# EasyEDA Pro project UnsungHeroes.eprj

# Schematic Schematic1

## Sheets
1 power_logic: Board Name: Board1; Create Date: 2026-03-30; Page Name: power_logic; Project Name: UnsungHeroes; Schematic Name: Schematic1; Update Date: 2026-05-08; Company: EasyEDA.com; Page Size: A4; Version: V1.0
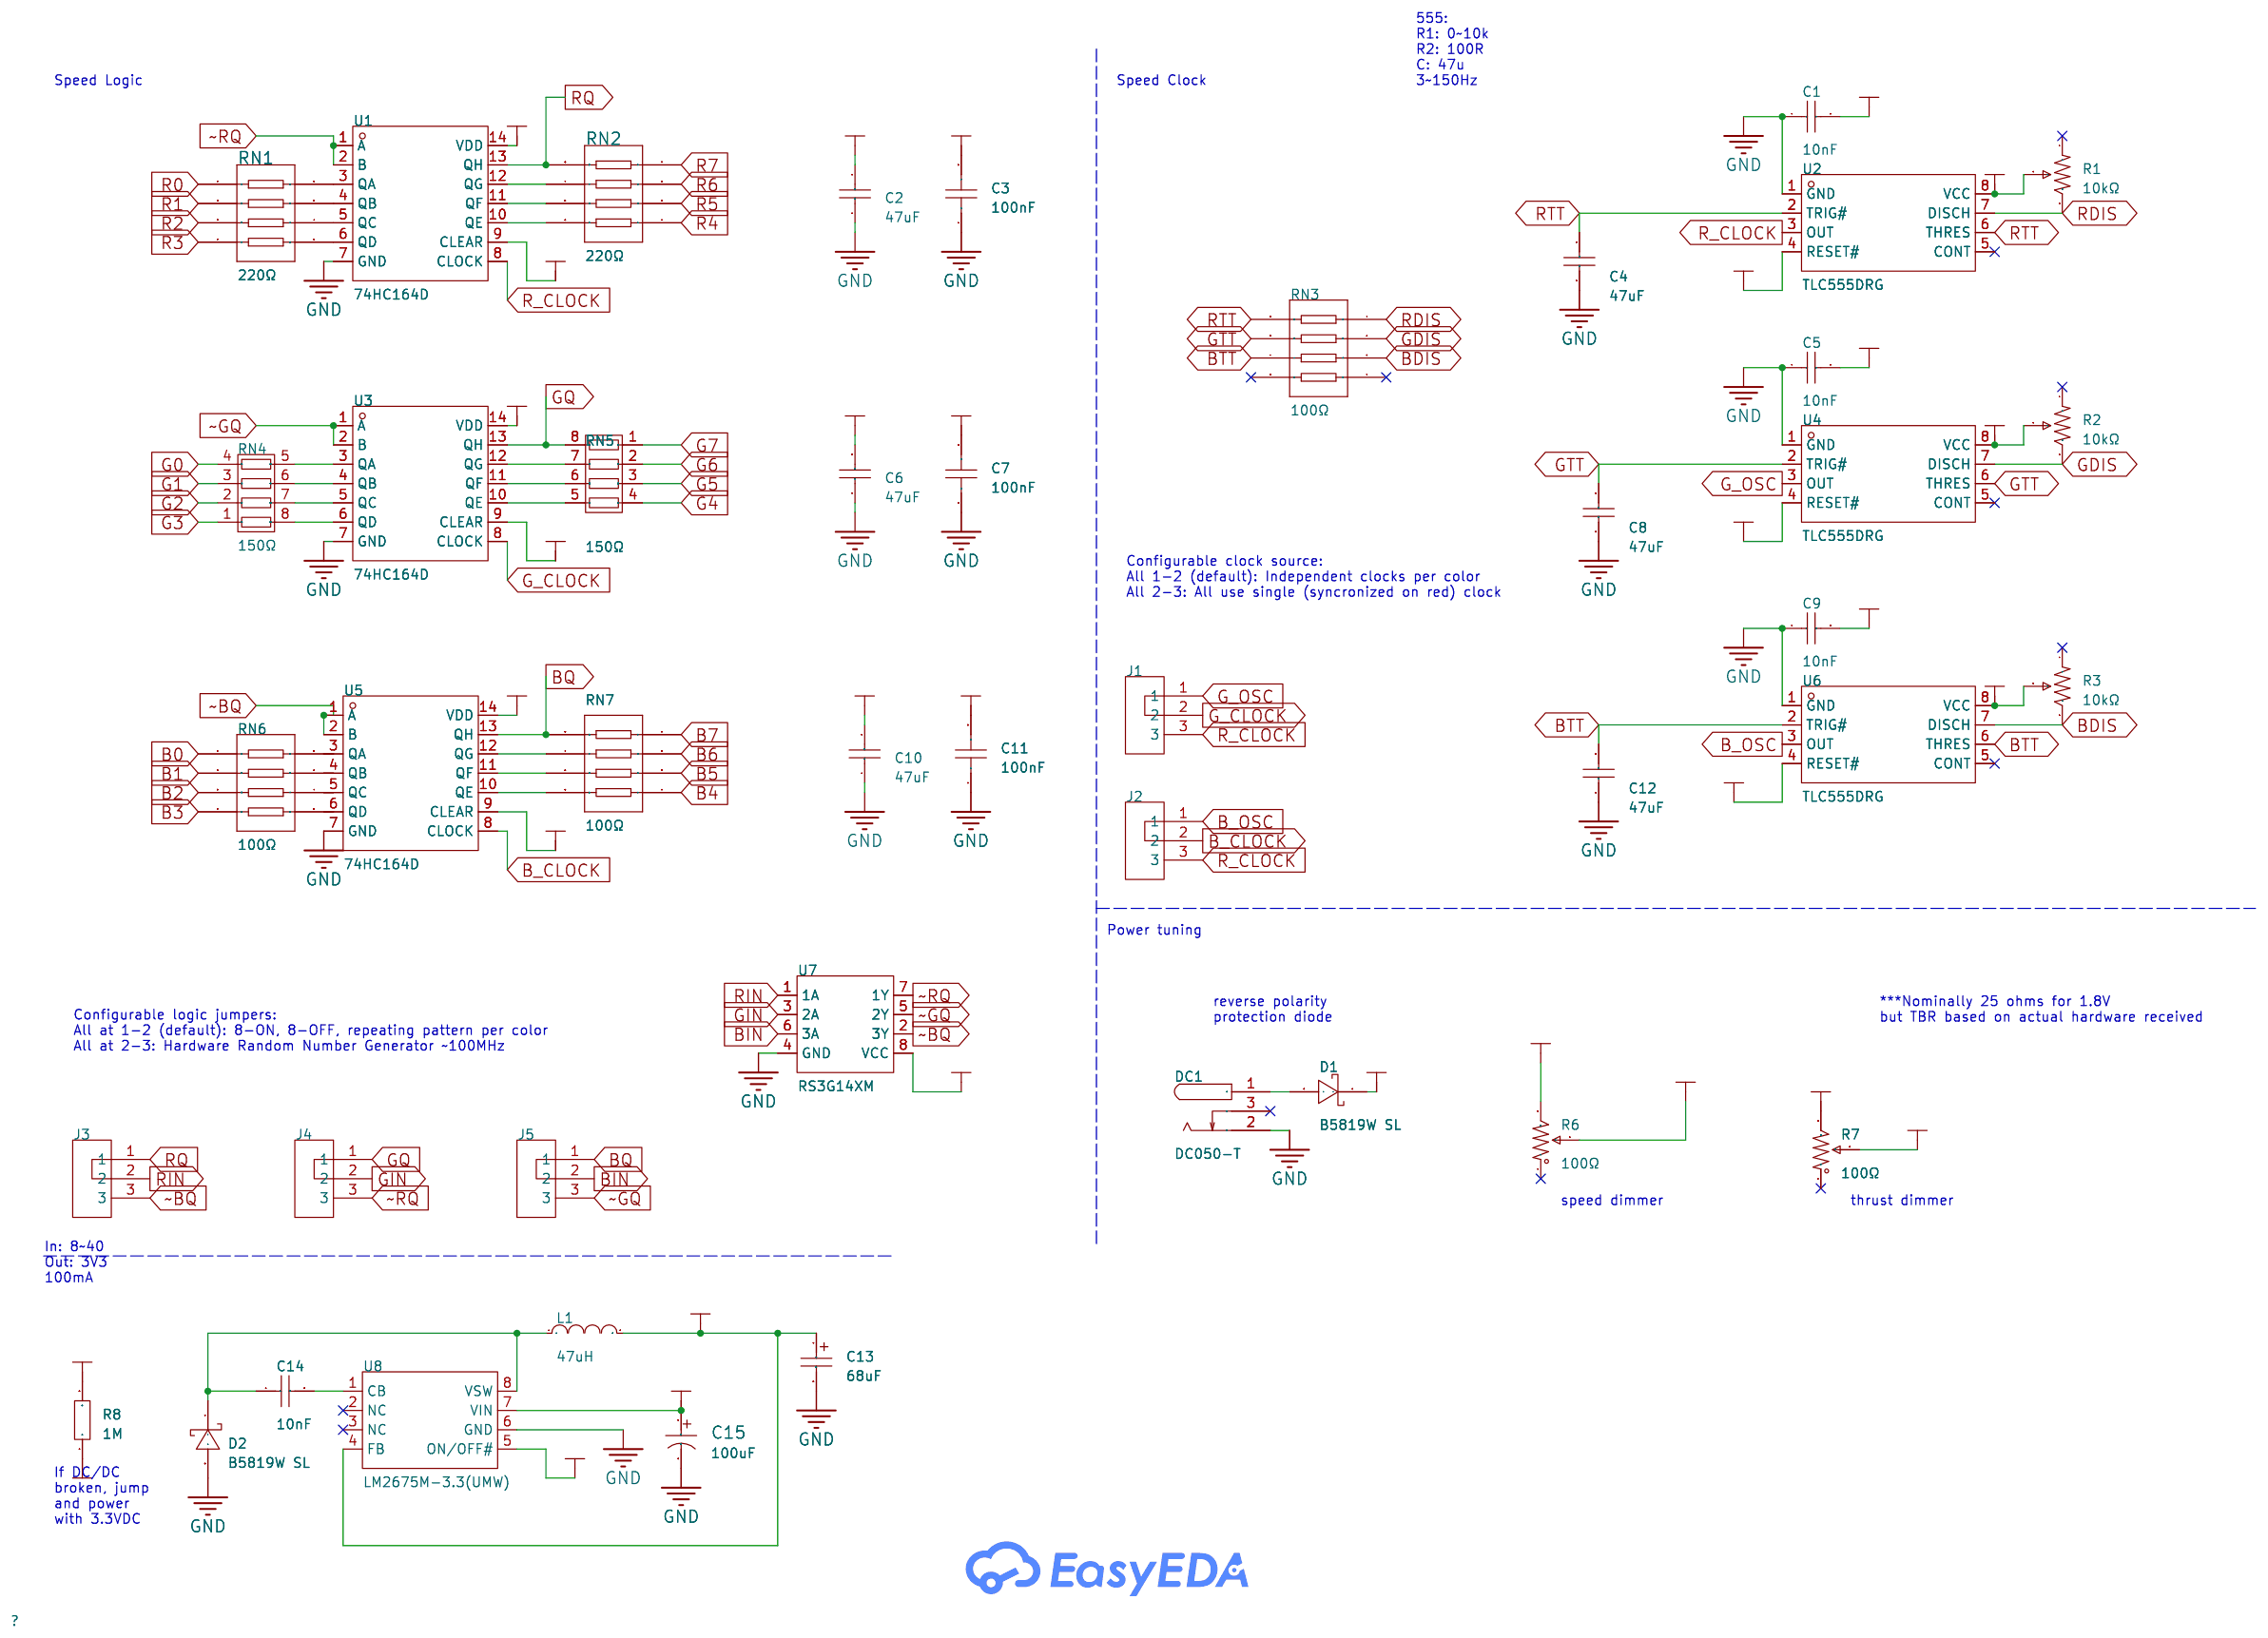
[diagram p0: power_logic]
2 led: Create Date: 2026-03-31; Page Name: led; Update Date: 2026-04-04
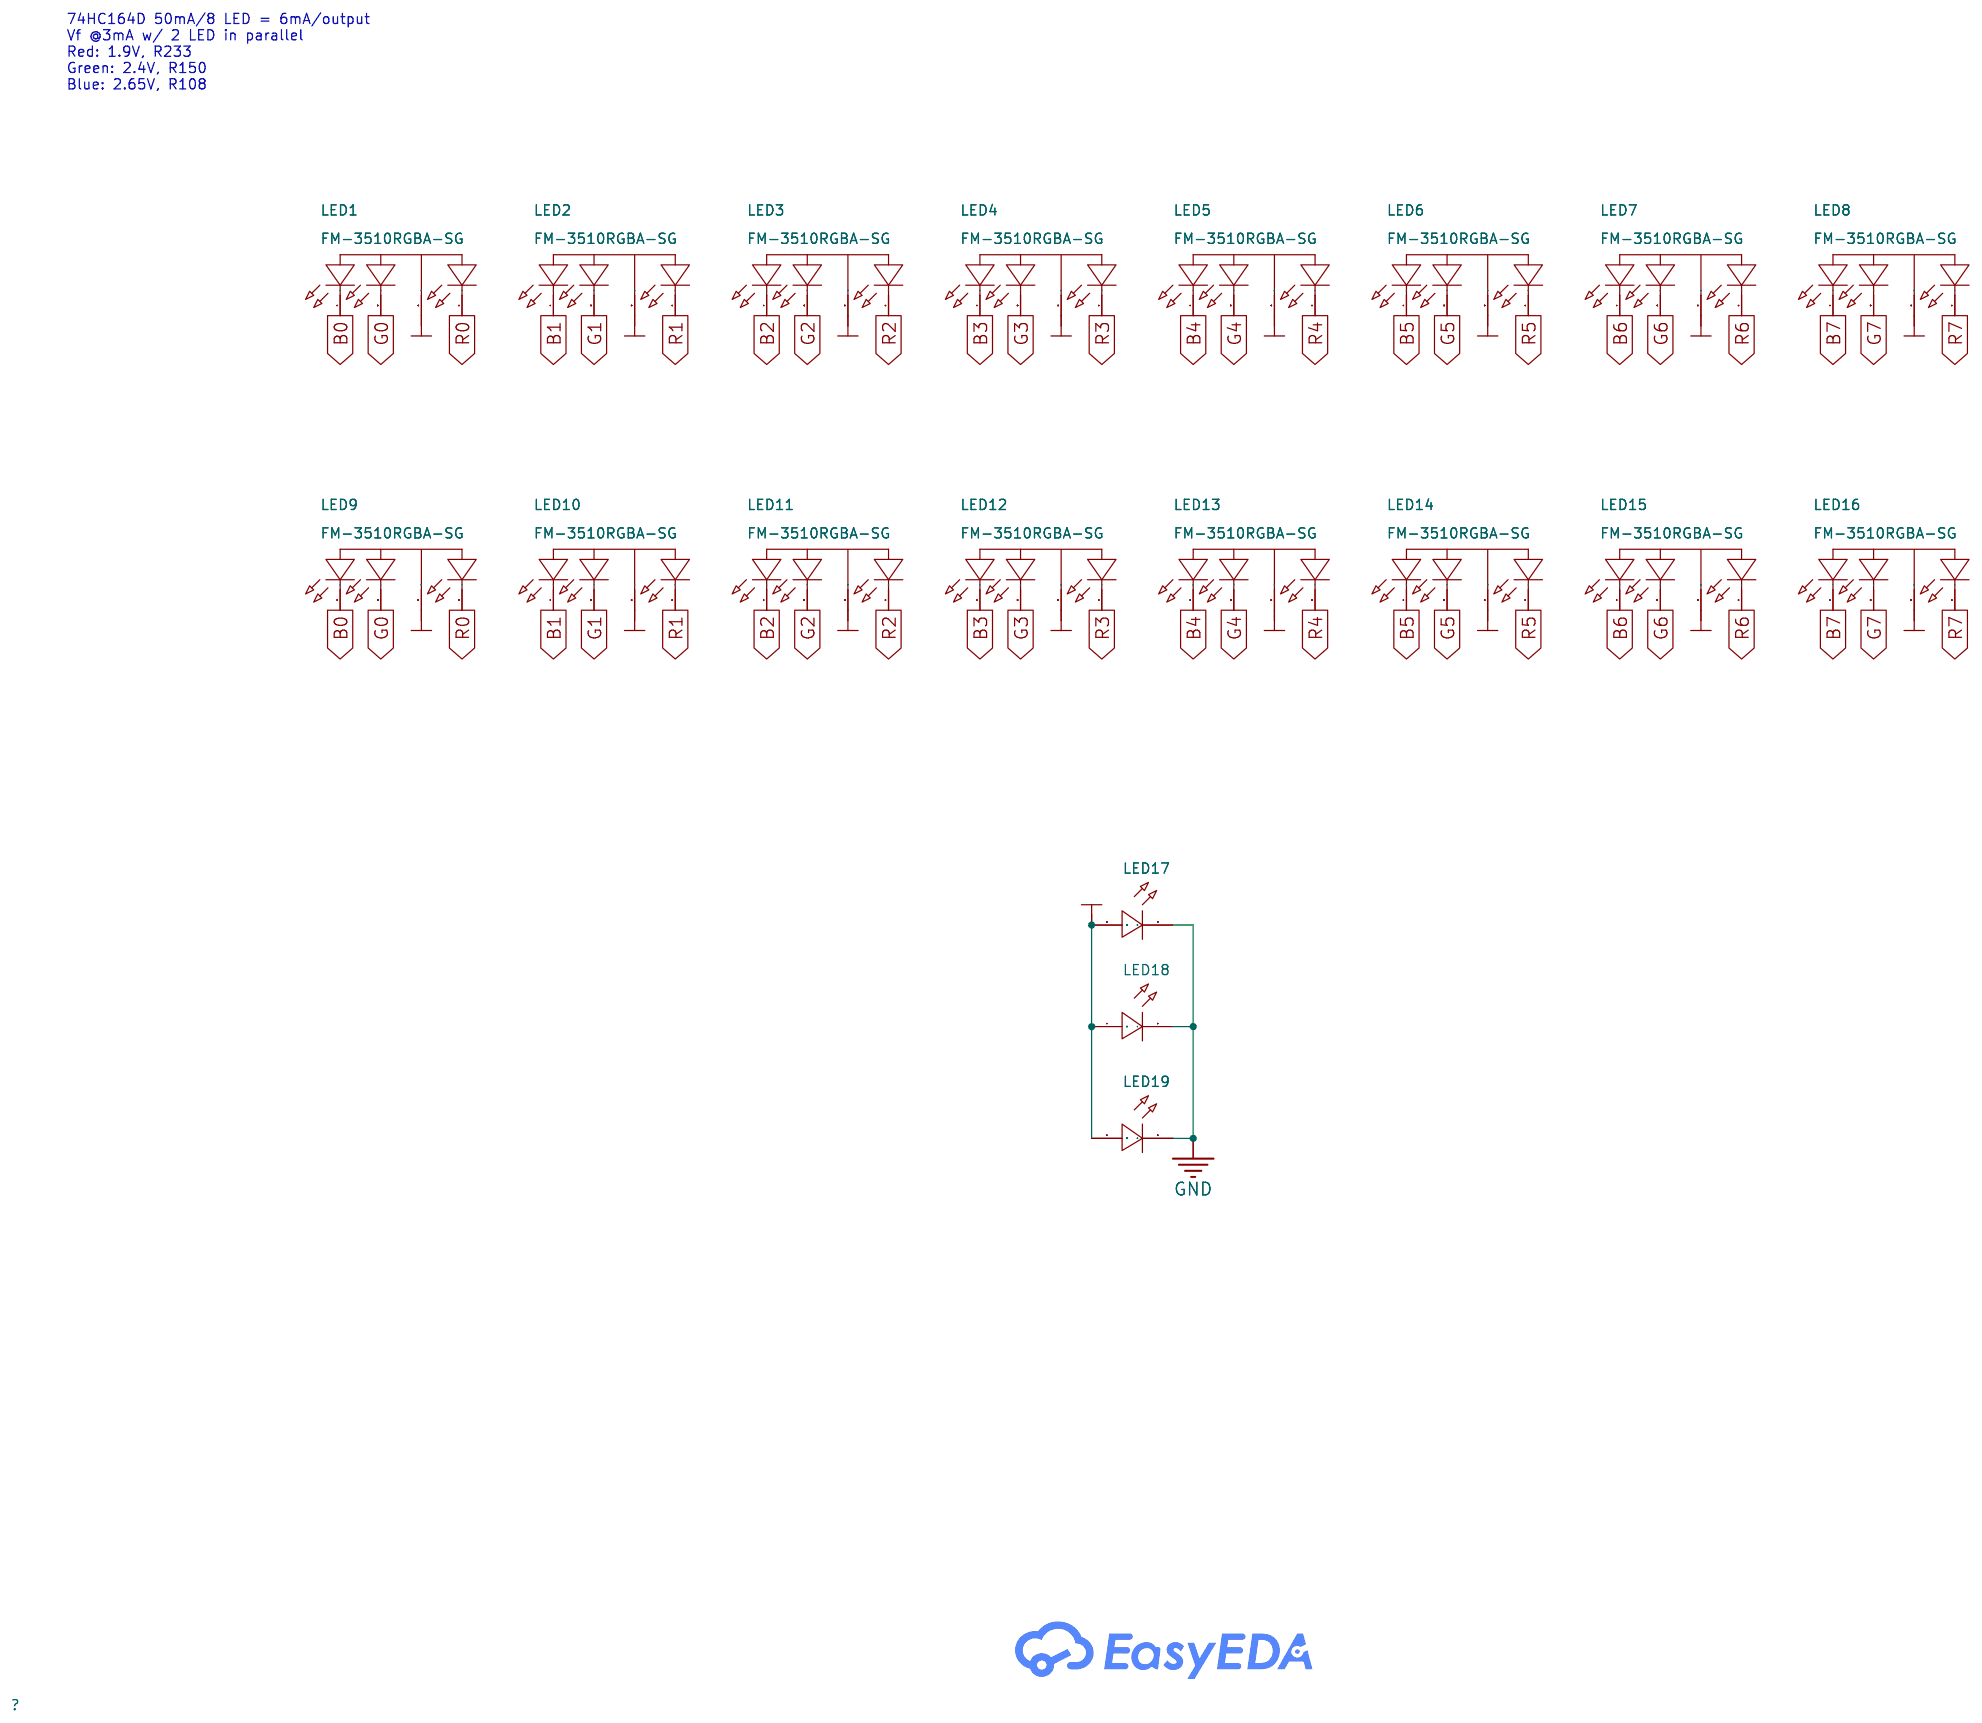
[diagram p1: led]

## Parts
sheet led
LED1  FM-3510RGBA-SG  [LED-SMD_FM-3510RGBA-SG]
LED2  FM-3510RGBA-SG  [LED-SMD_FM-3510RGBA-SG]
LED3  FM-3510RGBA-SG  [LED-SMD_FM-3510RGBA-SG]
LED4  FM-3510RGBA-SG  [LED-SMD_FM-3510RGBA-SG]
LED5  FM-3510RGBA-SG  [LED-SMD_FM-3510RGBA-SG]
LED6  FM-3510RGBA-SG  [LED-SMD_FM-3510RGBA-SG]
LED7  FM-3510RGBA-SG  [LED-SMD_FM-3510RGBA-SG]
LED8  FM-3510RGBA-SG  [LED-SMD_FM-3510RGBA-SG]
LED9  FM-3510RGBA-SG  [LED-SMD_FM-3510RGBA-SG]
LED10  FM-3510RGBA-SG  [LED-SMD_FM-3510RGBA-SG]
LED11  FM-3510RGBA-SG  [LED-SMD_FM-3510RGBA-SG]
LED12  FM-3510RGBA-SG  [LED-SMD_FM-3510RGBA-SG]
LED13  FM-3510RGBA-SG  [LED-SMD_FM-3510RGBA-SG]
LED14  FM-3510RGBA-SG  [LED-SMD_FM-3510RGBA-SG]
LED15  FM-3510RGBA-SG  [LED-SMD_FM-3510RGBA-SG]
LED16  FM-3510RGBA-SG  [LED-SMD_FM-3510RGBA-SG]
LED17  -  [3mm_cycling_led]  (no BOM)
LED18  -  [3mm_cycling_led]  (no BOM)
LED19  -  [3mm_cycling_led]  (no BOM)
sheet power_logic
C1  10nF  [C0402]
C2  47uF  [C0805]
C3  100nF  [C0402]
C4  47uF  [C0805]
C5  10nF  [C0402]
C6  47uF  [C0805]
C7  100nF  [C0402]
C8  47uF  [C0805]
C9  10nF  [C0402]
C10  47uF  [C0805]
C11  100nF  [C0402]
C12  47uF  [C0805]
C13  68uF  [CAP-SMD_L6.0-W3.2-R-RD]
C14  10nF  [C0402]
C15  100uF  [CAP-SMD_BD8.0-L8.3-W8.3-FD]
D1  B5819W SL  [SOD-123_L2.7-W1.6-LS3.7-RD-1]
D2  B5819W SL  [SOD-123_L2.7-W1.6-LS3.7-RD-1]
DC1  DC050-T  [DC-IN_DC050-T]
J1  -  [jumper3_12]  (no BOM)
J2  -  [jumper3_12]  (no BOM)
J3  -  [jumper3_12]  (no BOM)
J4  -  [jumper3_12]  (no BOM)
J5  -  [jumper3_12]  (no BOM)
L1  47uH  [L0805]
R1  10kΩ  [RES-ADJ-SMD_3P-L3.0-W3.8-P1.75-BR]
R2  10kΩ  [RES-ADJ-SMD_3P-L3.0-W3.8-P1.75-BR]
R3  10kΩ  [RES-ADJ-SMD_3P-L3.0-W3.8-P1.75-BR]
R6  100Ω  [RES-ADJ-SMD_TC33X-2-104E]
R7  100Ω  [RES-ADJ-SMD_TC33X-2-104E]
R8  1M  [R0805]  (no BOM)
RN1  220Ω  [RES-ARRAY-SMD_0402-8P-L2.0-W1.0-BL]
RN2  220Ω  [RES-ARRAY-SMD_0402-8P-L2.0-W1.0-BL]
RN3  100Ω  [RES-ARRAY-SMD_0402-8P-L2.0-W1.0-BL]
RN4  150Ω  [RES-ARRAY-SMD_0402-8P-L2.0-W1.0-BL]
RN5  150Ω  [RES-ARRAY-SMD_0402-8P-L2.0-W1.0-BL]
RN6  100Ω  [RES-ARRAY-SMD_0402-8P-L2.0-W1.0-BL]
RN7  100Ω  [RES-ARRAY-SMD_0402-8P-L2.0-W1.0-BL]
U1  74HC164D  [SOP-14_L8.6-W3.9-P1.27-LS6.0-BL]
U2  TLC555DRG  [SOP-8_L5.0-W3.9-P1.27-LS6.0-BL]
U3  74HC164D  [SOP-14_L8.6-W3.9-P1.27-LS6.0-BL]
U4  TLC555DRG  [SOP-8_L5.0-W3.9-P1.27-LS6.0-BL]
U5  74HC164D  [SOP-14_L8.6-W3.9-P1.27-LS6.0-BL]
U6  TLC555DRG  [SOP-8_L5.0-W3.9-P1.27-LS6.0-BL]
U7  RS3G14XM  [MSOP-8_L3.0-W3.0-P0.65-LS4.9-BL]
U8  LM2675M-3.3(UMW)  [SOIC-8_L4.9-W3.8-P1.27-LS6.0-BL]

## Library data of the parts
LED1-LED16 = FM-3510RGBA-SG: Diode Configuration:Common Anode Wavelength - Dominant:R:621nm；G:529nm；B:470nm Luminous Intensity:B:104mcd；R:445mcd；G:762mcd Viewing Angle:110° Forward Current:R:15mA；B:5mA；G:8mA Forward Voltage(Vf):G:2.7V；R:2.1V；B:2.7V Power(Watts):G:90mW；R:60mW；B:90mW I; LCSC Part Name: FFC排线B面（反面）; Supplier Part: C727903; Manufacturer: 国星光电; Supplier Footprint: SMD,3.5x1.3mm; JLCPCB Part Class: Extended Part; Datasheet: https://item.szlcsc.com/datasheet/FM-3510RGBA-SG/775226.html; Supplier: LCSC; Diode Configuration: Common Anode; Wavelength - Dominant: R:621nm；G:529nm；B:470nm; Luminous Intensity: B:104mcd；R:445mcd；G:762mcd; Viewing Angle: 110°; Forward Current: R:15mA；B:5mA；G:8mA; Forward Voltage(Vf): G:2.7V；R:2.1V；B:2.7V; Power(Watts): G:90mW；R:60mW；B:90mW; Installation Method: Side View Mount; Operating Temperature: -30℃~+85℃; Length: 3.5mm; Width: 1.2mm; Height: 1mm
LED17-LED19 = LED_TH-R_3mm: Supplier Footprint: Through
C1 C5 C9 C14 = CL05B103KB5NNNC: LCSC Part Name: 10nF ±10% 50V; Supplier Part: C15195; Manufacturer: SAMSUNG(三星); Supplier Footprint: 0402; JLCPCB Part Class: Basic Part; Datasheet: https://item.szlcsc.com/datasheet/CL05B103KB5NNNC/15869.html; Supplier: LCSC; Tolerance: ±10%; Voltage Rating: 50V; Temperature Coefficient: X7R
C2 C4 C6 C8 C10 C12 = CL21A476MQYNNNE: LCSC Part Name: 47uF ±20% 6.3V; Supplier Part: C16780; Manufacturer: SAMSUNG(三星); Supplier Footprint: 0805; JLCPCB Part Class: Basic Part; Datasheet: https://item.szlcsc.com/datasheet/CL21A476MQYNNNE/17464.html; Supplier: LCSC; Tolerance: ±20%; Voltage Rating: 6.3V; Temperature Coefficient: X5R
C3 C7 C11 = CL05B104KO5NNNC: LCSC Part Name: 100nF ±10% 16V; Supplier Part: C1525; Manufacturer: SAMSUNG(三星); Supplier Footprint: 0402; JLCPCB Part Class: Basic Part; Datasheet: https://item.szlcsc.com/datasheet/CL05B104KO5NNNC/1877.html; Supplier: LCSC; Tolerance: ±10%; Voltage Rating: 16V; Temperature Coefficient: X7R
C13 = TAJC686K016RNJ: LCSC Part Name: 68uF ±10% 16V; Supplier Part: C7220; Manufacturer: Kyocera AVX; Supplier Footprint: CASE-C-6032-28(mm); JLCPCB Part Class: Extended Part; Supplier: LCSC; Tolerance: ±10%; Voltage Rating: 16V; Equivalent Series Resistance(ESR): 1.3Ω@100kHz; Operating Temperature: -55℃~+125℃
C15 = UUD1H101MNL1GS: LCSC Part Name: 100uF ±20% 50V; Supplier Part: C116241; Manufacturer: Nichicon(尼吉康); Supplier Footprint: SMD,D8xL10mm; JLCPCB Part Class: Extended Part; Datasheet: https://item.szlcsc.com/datasheet/UUD1H101MNL1GS/117494.html; Supplier: LCSC; Tolerance: ±20%; Voltage Rating: 50V; Ripple Current: 150mA@120Hz; Diameter: 8mm; Height - Seated (Max): 10.5mm; Lifetime: 5000hrs@105℃; Operating Temperature: -55℃~+105℃
D1 D2 = B5819W SL: LCSC Part Name: 电压:40V 电流:1A; Supplier Part: C8598; Manufacturer: CJ(江苏长电/长晶); Supplier Footprint: SOD-123; JLCPCB Part Class: Basic Part; Datasheet: https://item.szlcsc.com/datasheet/B5819W%2520SL/9093.html; Supplier: LCSC; Voltage - Forward(Vf@If): 600mV@1A; Voltage - DC Reverse(Vr): 40V; Current - Rectified: 1A; Non-Repetitive Peak Forward Surge Current: 9A
DC1 = DC050-T: LCSC Part Name: DC050-2.0贴片全铜; Supplier Part: C431534; Manufacturer: SHOU HAN(首韩); Supplier Footprint: SMD; JLCPCB Part Class: Extended Part; Datasheet: https://item.szlcsc.com/datasheet/DC050-T/427891.html; Supplier: LCSC; Connector Type: DC Power Jack; Mounting Type: Surface Mount, Right Angle; Inside Contact Diameter: 2mm; Outside Contact Diameter: 6.5mm; Current Rating: 1.5A; Voltage Rating (Max): 12V; Operating Temperature: -30℃~+70℃
J1-J5 = jumper3_12
L1 = CMI201212J470KT: LCSC Part Name: 47uH ±10%; Supplier Part: C105499; Manufacturer: FH(风华); Supplier Footprint: 0805; JLCPCB Part Class: Extended Part; Datasheet: https://atta.szlcsc.com/upload/public/pdf/source/20230223/B5A9234764BD8EE53116685FAFCB16FA.pdf; Supplier: LCSC; Tolerance: ±10%
R1-R3 = TC33X-2-103E: LCSC Part Name: 10kΩ ±25%; Supplier Part: C719176; Manufacturer: BOURNS; Supplier Footprint: SMD-3P,3.8x3.6mm; JLCPCB Part Class: Extended Part; Datasheet: https://item.szlcsc.com/datasheet/TC33X-2-103E/762158.html; Supplier: LCSC; Tolerance: ±25%; Power(Watts): 150mW; Temperature Coefficient: ±250ppm/℃
R6 R7 = TC33X-2-101E: LCSC Part Name: 100Ω ±25%; Supplier Part: C911390; Manufacturer: BOURNS; Supplier Footprint: SMD-3P,3.8x3.6mm; JLCPCB Part Class: Extended Part; Datasheet: https://atta.szlcsc.com/upload/public/pdf/source/20220616/5D231045F8526729C8573114585418F2.pdf; Supplier: LCSC; Tolerance: ±25%; Temperature Coefficient: ±250ppm/℃
R8 = Res_0805: Supplier Footprint: 0805
RN1 RN2 = 4D02WGJ0221TCE: LCSC Part Name: 220Ω ±5%; Supplier Part: C25498; Manufacturer: UNI-ROYAL(厚声); Supplier Footprint: 0402x4; JLCPCB Part Class: Extended Part; Datasheet: https://item.szlcsc.com/datasheet/4D02WGJ0221TCE/26241.html; Supplier: LCSC; Tolerance: ±5%; Power(Watts): 62.5mW; Temperature Coefficient: ±200ppm/℃
RN3 RN6 RN7 = 4D02WGJ0101TCE: LCSC Part Name: 100Ω ±5%; Supplier Part: C48442; Manufacturer: UNI-ROYAL(厚声); Supplier Footprint: 0402x4; JLCPCB Part Class: Extended Part; Datasheet: https://item.szlcsc.com/datasheet/4D02WGJ0101TCE/49449.html; Supplier: LCSC; Tolerance: ±5%; Power(Watts): 62.5mW; Temperature Coefficient: ±200ppm/℃
RN4 RN5 = RTA02-4D151JTH: LCSC Part Name: 150Ω ±5%; Supplier Part: C332209; Manufacturer: RALEC(旺诠); Supplier Footprint: 0402x4; JLCPCB Part Class: Extended Part; Datasheet: https://item.szlcsc.com/datasheet/RTA02-4D151JTH/310999.html; Supplier: LCSC; Tolerance: ±5%; Power(Watts): 62.5mW; Temperature Coefficient: ±200ppm/℃
U1 U3 U5 = 74HC164D_C86610: Supplier Part: C86610; Manufacturer: FM(富满); Supplier Footprint: SOP-14; JLCPCB Part Class: Extended Part; Datasheet: https://item.szlcsc.com/datasheet/74HC164D/87787.html; Supplier: LCSC; Function: Serial-to-Parallel; Voltage - Supply: 2V~6V; Clock Frequency: 28MHz; Number of Bits per Element: 8; Series: 74HC; Operating Temperature: -40℃~+85℃; Propagation Delay: 38ns@6V,50pF
U2 U4 U6 = TLC555DRG: Supplier Part: C5145349; Manufacturer: HGC(深圳汉芯); Supplier Footprint: SOP-8; JLCPCB Part Class: Extended Part; Datasheet: https://item.szlcsc.com/datasheet/TLC555DRG/5767716.html; Supplier: LCSC
U7 = RS3G14XM: LCSC Part Name: 三施密特触发器反相器; Supplier Part: C5372562; Manufacturer: RUNIC(润石); Supplier Footprint: MSOP-8; JLCPCB Part Class: Extended Part; Datasheet: https://item.szlcsc.com/datasheet/RS3G14XM/6223614.html; Supplier: LCSC
U8 = LM2675M-3.3(UMW): LCSC Part Name: 降压型 1A 7V~40V; Supplier Part: C5563863; Manufacturer: UMW(友台半导体); Supplier Footprint: SOP-8; JLCPCB Part Class: Extended Part; Datasheet: https://item.szlcsc.com/datasheet/LM2675M-3.3(UMW)/6481729.html; Supplier: LCSC; Function: Buck; Voltage - Supply: 7V~40V; Output Voltage: 3.3V; Output Current: 1A; Frequency - Switching: 220kHz; Operating Temperature: -40℃~+85℃; Synchronous Rectifier: No; Number of Outputs: 1; Topology: Buck; Quiescent Current: 3mA; Switch tube (built-in/external): Built-in; Output Type: Fixed

## Nets
3V3: C13.1 L1.2 R6.3 R7.3 R8.1 U8.4(FB)
3V3S: C1.2 C2.2 C3.2 C5.2 C6.2 C7.2 C9.2 C10.2 C11.2 LED1.2(+) LED2.2(+) LED3.2(+) LED4.2(+) LED5.2(+) LED6.2(+) LED7.2(+) LED8.2(+) LED9.2(+) LED10.2(+) LED11.2(+) LED12.2(+) LED13.2(+) LED14.2(+) LED15.2(+) LED16.2(+) R1.2 R2.2 R3.2 R6.2 U1.9(CLEAR) U1.14(VDD) U2.4(RESET#) U2.8(VCC) U3.9(CLEAR) U3.14(VDD) U4.4(RESET#) U4.8(VCC) U5.9(CLEAR) U5.14(VDD) U6.4(RESET#) U6.8(VCC) U7.8(VCC)
3V3T: LED17.1(C) LED18.1(C) LED19.1(C) R7.2
24V: C15.1 D1.1(-) R8.2 U8.5(ON/OFF#) U8.7(VIN)
GND: C1.1 C2.1 C3.1 C4.2 C5.1 C6.1 C7.1 C8.2 C9.1 C10.1 C11.1 C12.2 C13.2 C15.2 D2.2(+) DC1.2 LED17.2(A) LED18.2(A) LED19.2(A) U1.7(GND) U2.1(GND) U3.7(GND) U4.1(GND) U5.7(GND) U6.1(GND) U7.4(GND) U8.6(GND)
B0: LED1.4(-) LED9.4(-) RN6.4
B1: LED2.4(-) LED10.4(-) RN6.3
B2: LED3.4(-) LED11.4(-) RN6.2
B3: LED4.4(-) LED12.4(-) RN6.1
B4: LED5.4(-) LED13.4(-) RN7.4
B5: LED6.4(-) LED14.4(-) RN7.3
B6: LED7.4(-) LED15.4(-) RN7.2
B7: LED8.4(-) LED16.4(-) RN7.1
B_CLOCK: J2.2 U5.8(CLOCK)
B_OSC: J2.1 U6.3(OUT)
BDIS: R3.3 RN3.2 U6.7(DISCH)
BIN: J5.2 U7.6(3A)
BQ: J5.1 RN7.8 U5.13(QH)
BTT: C12.1 RN3.7 U6.2(TRIG#) U6.6(THRES)
G0: LED1.3(-) LED9.3(-) RN4.4(R4.1)
G1: LED2.3(-) LED10.3(-) RN4.3(R3.1)
G2: LED3.3(-) LED11.3(-) RN4.2(R2.1)
G3: LED4.3(-) LED12.3(-) RN4.1(R1.1)
G4: LED5.3(-) LED13.3(-) RN5.4(R4.1)
G5: LED6.3(-) LED14.3(-) RN5.3(R3.1)
G6: LED7.3(-) LED15.3(-) RN5.2(R2.1)
G7: LED8.3(-) LED16.3(-) RN5.1(R1.1)
G_CLOCK: J1.2 U3.8(CLOCK)
G_OSC: J1.1 U4.3(OUT)
GDIS: R2.3 RN3.3 U4.7(DISCH)
GIN: J4.2 U7.3(2A)
GQ: J4.1 RN5.8(R1.2) U3.13(QH)
GTT: C8.1 RN3.6 U4.2(TRIG#) U4.6(THRES)
R0: LED1.1(-) LED9.1(-) RN1.4
R1: LED2.1(-) LED10.1(-) RN1.3
R2: LED3.1(-) LED11.1(-) RN1.2
R3: LED4.1(-) LED12.1(-) RN1.1
R4: LED5.1(-) LED13.1(-) RN2.4
R5: LED6.1(-) LED14.1(-) RN2.3
R6: LED7.1(-) LED15.1(-) RN2.2
R7: LED8.1(-) LED16.1(-) RN2.1
R_CLOCK: J1.3 J2.3 U1.8(CLOCK) U2.3(OUT)
RDIS: R1.3 RN3.4 U2.7(DISCH)
RIN: J3.2 U7.1(1A)
RQ: J3.1 RN2.8 U1.13(QH)
RTT: C4.1 RN3.5 U2.2(TRIG#) U2.6(THRES)
~BQ: J3.3 U5.1(A) U5.2(B) U7.2(3Y)
~GQ: J5.3 U3.1(A) U3.2(B) U7.5(2Y)
~RQ: J4.3 U1.1(A) U1.2(B) U7.7(1Y)
$1N6423: RN2.5 U1.10(QE)
$1N6425: RN2.6 U1.11(QF)
$1N6427: RN2.7 U1.12(QG)
$1N6920: D1.2(+) DC1.1
$1N7048: RN5.5(R4.2) U3.10(QE)
$1N7050: RN5.6(R3.2) U3.11(QF)
$1N7052: RN5.7(R2.2) U3.12(QG)
$1N7110: RN4.5(R4.2) U3.3(QA)
$1N7112: RN4.6(R3.2) U3.4(QB)
$1N7114: RN4.7(R2.2) U3.5(QC)
$1N7116: RN4.8(R1.2) U3.6(QD)
$1N7226: RN7.5 U5.10(QE)
$1N7228: RN7.6 U5.11(QF)
$1N7230: RN7.7 U5.12(QG)
$1N8445: C14.2 U8.1(CB)
$1N8452: C14.1 D2.1(-) L1.1 U8.8(VSW)
$1N14384: RN6.5 U5.3(QA)
$1N14386: RN6.6 U5.4(QB)
$1N14388: RN6.7 U5.5(QC)
$1N14390: RN6.8 U5.6(QD)
$1N14524: RN1.5 U1.3(QA)
$1N14526: RN1.6 U1.4(QB)
$1N14528: RN1.7 U1.5(QC)
$1N14530: RN1.8 U1.6(QD)

Not connected (* = marked no-connect by the designer): DC1 3*; R1 1*; R2 1*; R3 1*; R6 1*; R7 1*; RN3 1* 8*; U2 5(CONT)*; U4 5(CONT)*; U6 5(CONT)*; U8 2(NC)* 3(NC)*

## Notes on the sheets
sheet 1
- Speed Logic
- Speed Clock
- 555:
  R1: 0~10k
  R2: 100R
  C: 47u
  3~150Hz
- Configurable clock source:
  All 1-2 (default): Independent clocks per color
  All 2-3: All use single (syncronized on red) clock
- Power tuning
- reverse polarity
  protection diode
- ***Nominally 25 ohms for 1.8V
  but TBR based on actual hardware received
- Configurable logic jumpers:
  All at 1-2 (default): 8-ON, 8-OFF, repeating pattern per color
  All at 2-3: Hardware Random Number Generator ~100MHz
- speed dimmer
- thrust dimmer
- In: 8~40
  Out: 3V3
  100mA
- If DC/DC
  broken, jump
  and power
  with 3.3VDC
sheet 2
- 74HC164D 50mA/8 LED = 6mA/output
  Vf @3mA w/ 2 LED in parallel
  Red: 1.9V, R233
  Green: 2.4V, R150
  Blue: 2.65V, R108

# Board PCB1
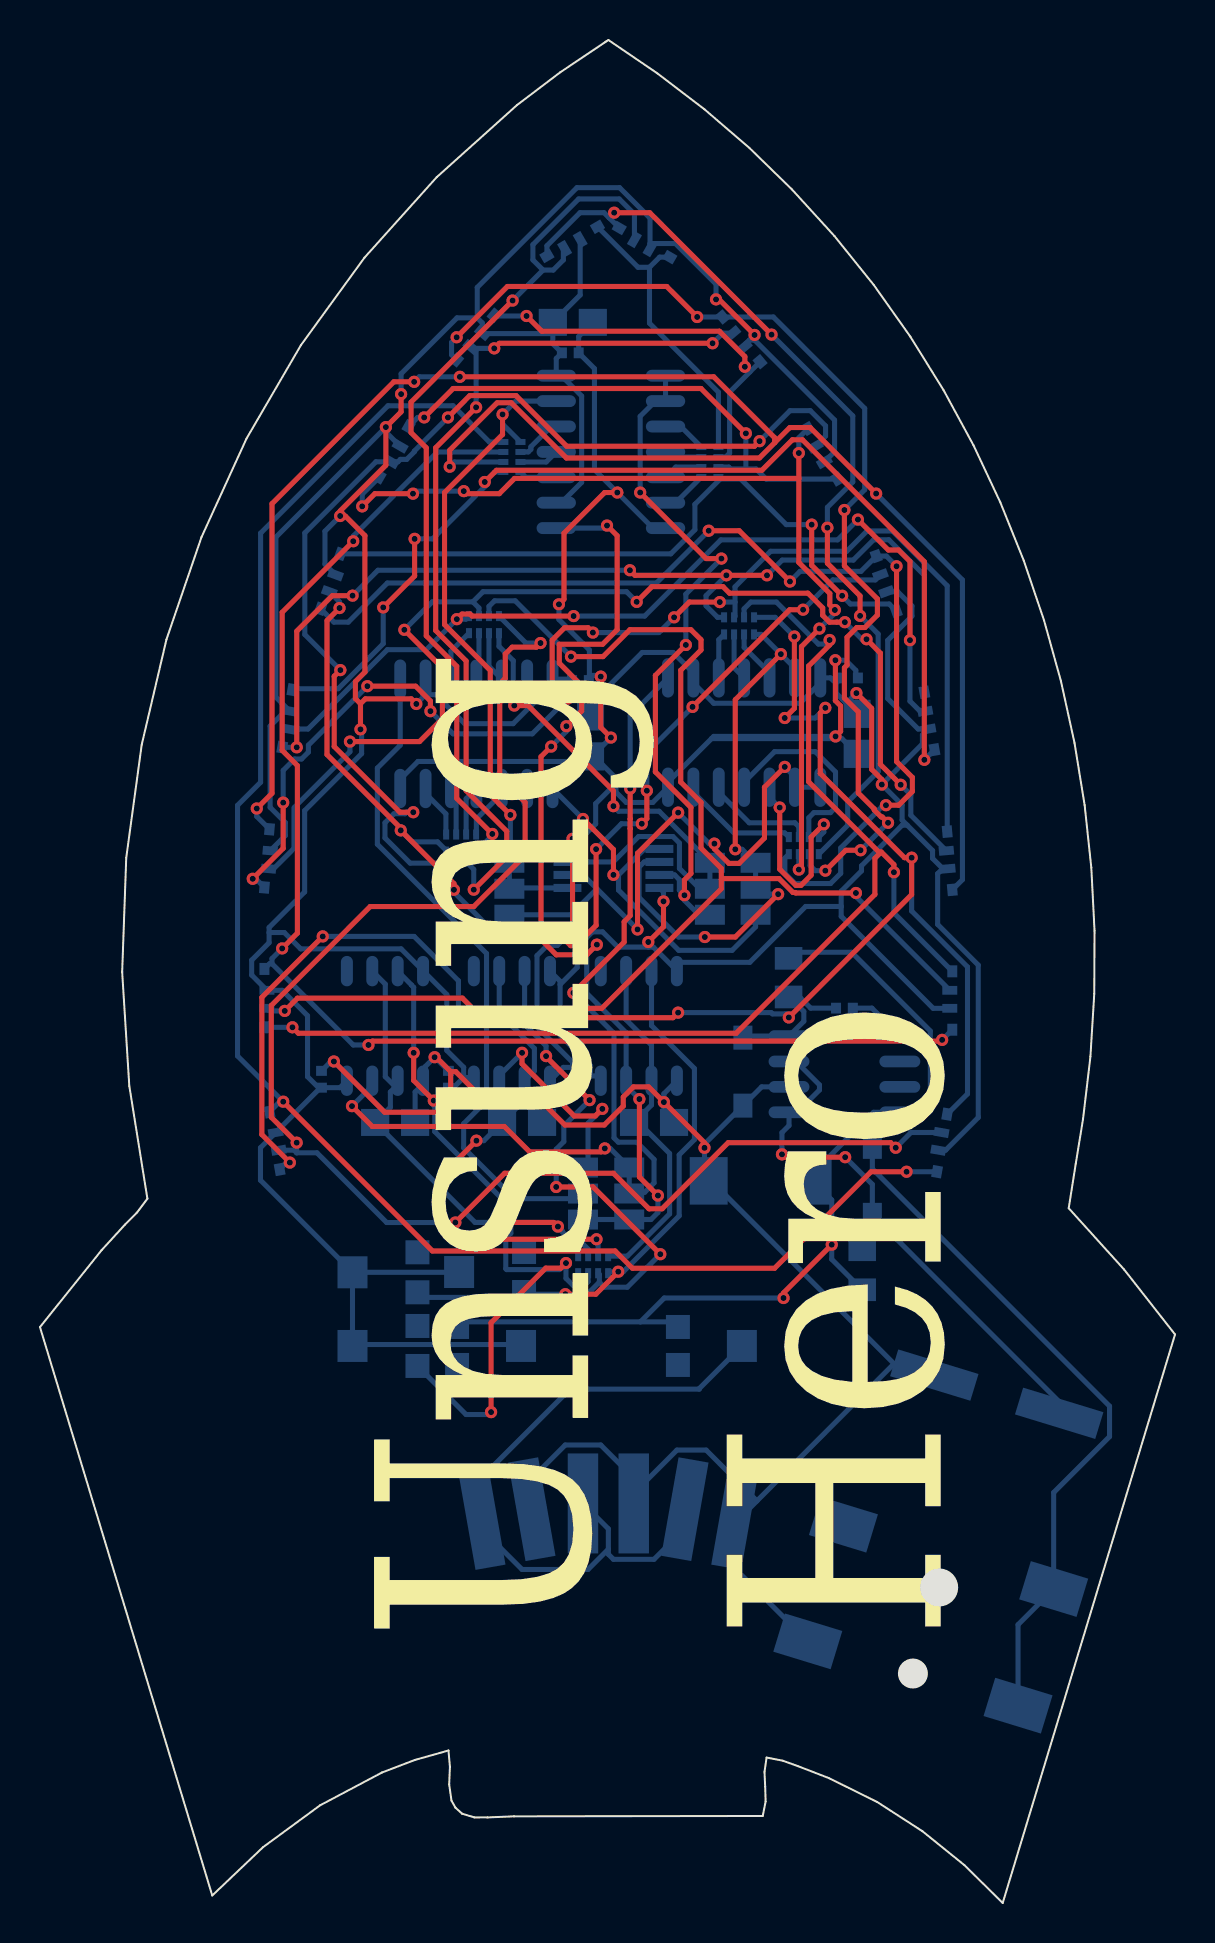
[diagram p2: board, top side]
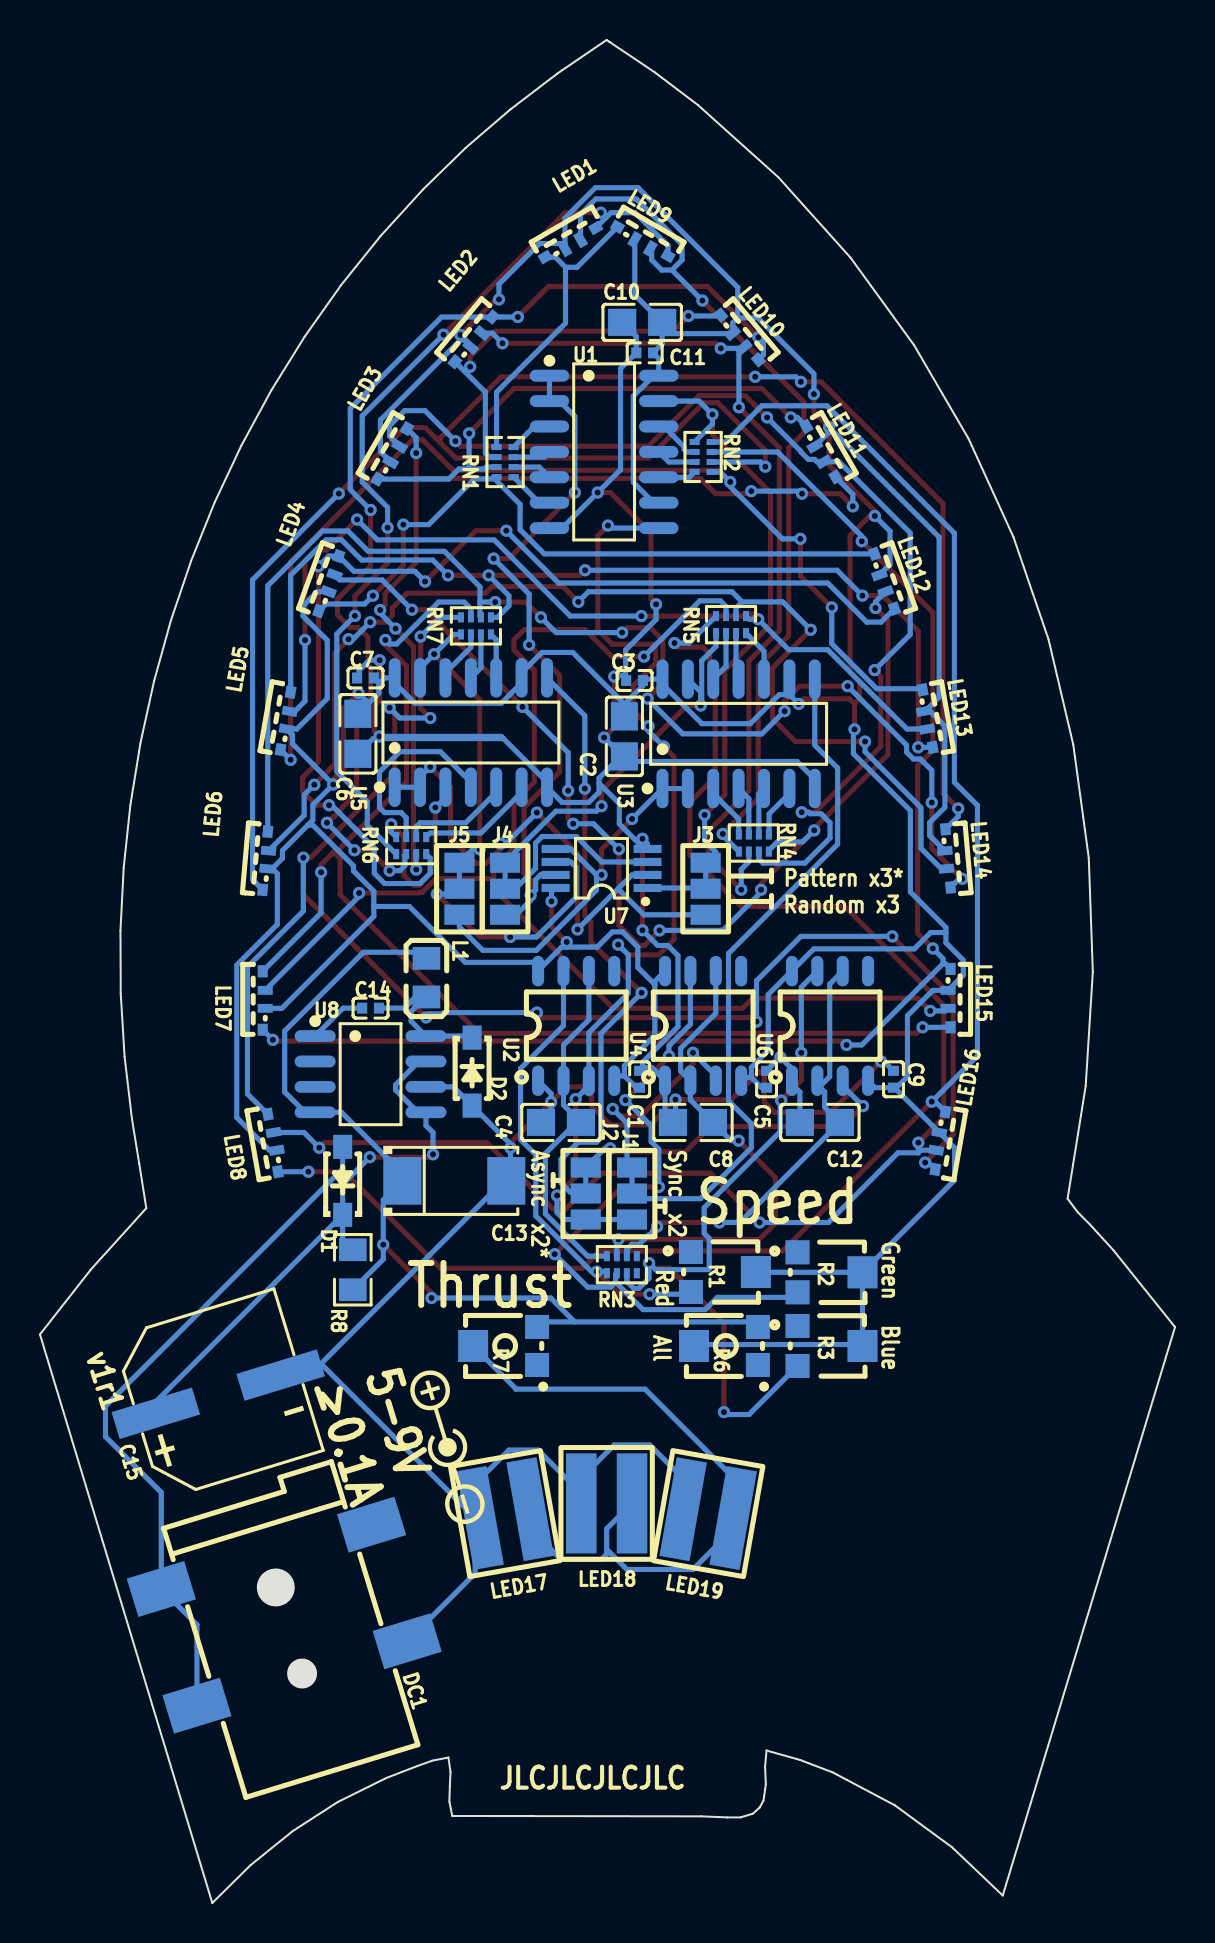
[diagram p3: board, bottom side, seen from below]

Outline 56.79 x 93.15 mm; copper layers: Top Layer, Bottom Layer. Coordinates in mm from the lower left corner of the outline.
Outline path: 0,28.8 8.62,0.38 11.17,2.8 14.01,4.88 17.12,6.53 18.75,7.15 20.44,7.63 20.51,6.81 20.47,5.94 20.59,5.12 20.78,4.77 21.12,4.47 21.74,4.28 22.4,4.28 23.72,4.33 36.16,4.35 36.3,5.07 36.28,5.81 36.25,6.55 36.35,7.27 37.16,7.12 37.93,6.84 39.47,6.24 41.89,5.05 44.15,3.59 46.25,1.89 48.17,0 56.79,28.43 54.24,31.68 51.47,34.74 51.82,36.96 52.18,39.19 52.55,42.32 52.75,45.46 52.76,48.61 52.6,51.76 52.27,54.9 51.76,58.01 51.08,61.09 50.24,64.13 49.22,67.11 48.05,70.04 46.71,72.89 45.2,75.65 43.54,78.32 41.72,80.89 39.75,83.35 37.62,85.69 35.49,87.75 33.25,89.69 30.89,91.48 28.44,93.15 28.34,93.09 28.28,93.05 26.03,91.54 23.87,89.9 19.85,86.29 16.24,82.27 13.06,77.9 10.33,73.22 8.08,68.29 6.33,63.17 5.09,57.91 4.32,52.26 4.11,46.55 4.47,40.85 5.37,35.22 4.86,34.53 4.25,33.92 3.09,32.65 0,28.8
Stack: Top Layer 0.035mm / Dielectric1 1.51mm FR4 er 4.5 / Bottom Layer 0.035mm

## Design rules (mm)
template: JLCPCB Capability(Two Layers Board)
spacing copperThickness1oz (default): track to track 0.102, other pairs 0.152 to 0.3
spacing copperThickness2oz: track to track 0.203, other pairs 0.152 to 0.3
track width copperThickness1oz (default): min 0.127, default 0.254, max 2.54
track width copperThickness2oz: min 0.203, default 0.254, max 2.54
differential pair differentialPair (default): width min 0.127, default 0.254, max 2.54; gap min 0.152, default 0.152
via viaSize (default): diameter min 0.5, default 0.61, max 10; hole min 0.3, default 0.305, max 6.3

## Placement (name value [footprint] x y rotation side)
C1  10nF  [C0402]  26.79 41.19 270 bottom
C2  47uF  [C0805]  27.55 58.33 90 bottom
C3  100nF  [C0402]  27.04 61.13 180 bottom
C4  47uF  [C0805]  30.72 39.03 0 bottom
C5  10nF  [C0402]  20.44 41.19 270 bottom
C6  47uF  [C0805]  40.88 58.46 90 bottom
C7  100nF  [C0402]  40.5 61.25 180 bottom
C8  47uF  [C0805]  24.12 39.03 0 bottom
C9  10nF  [C0402]  14.09 41.19 270 bottom
C10  47uF  [C0805]  26.66 79.03 180 bottom
C11  100nF  [C0402]  26.53 77.51 180 bottom
C12  47uF  [C0805]  17.77 39.03 0 bottom
C13  68uF  [CAP-SMD_L6.0-W3.2-R-RD]  36.06 36.11 0 bottom
C14  10nF  [C0402]  40.25 44.74 0 bottom
C15  100uF  [CAP-SMD_BD8.0-L8.3-W8.3-FD]  47.87 25.44 163 bottom
D1  B5819W SL  [SOD-123_L2.7-W1.6-LS3.7-RD-1]  41.64 36.11 90 bottom
D2  B5819W SL  [SOD-123_L2.7-W1.6-LS3.7-RD-1]  35.17 41.57 270 bottom
DC1  DC050-T  [DC-IN_DC050-T]  44.57 14.39 253 bottom
J1  -  [jumper3_12]  27.17 35.47 270 bottom
J2  -  [jumper3_12]  29.48 35.48 270 bottom
J3  -  [jumper3_12]  23.48 50.71 270 bottom
J4  -  [jumper3_12]  33.52 50.71 270 bottom
J5  -  [jumper3_12]  35.8 50.71 270 bottom
L1  47uH  [L0805]  37.45 46.27 90 bottom
LED1  FM-3510RGBA-SG  [LED-SMD_FM-3510RGBA-SG]  30.21 82.97 150 bottom
LED2  FM-3510RGBA-SG  [LED-SMD_FM-3510RGBA-SG]  35.04 78.14 130 bottom
LED3  FM-3510RGBA-SG  [LED-SMD_FM-3510RGBA-SG]  39.11 72.43 120 bottom
LED4  FM-3510RGBA-SG  [LED-SMD_FM-3510RGBA-SG]  42.28 65.95 110 bottom
LED5  FM-3510RGBA-SG  [LED-SMD_FM-3510RGBA-SG]  44.44 59.09 100 bottom
LED6  FM-3510RGBA-SG  [LED-SMD_FM-3510RGBA-SG]  45.45 52.11 95 bottom
LED7  FM-3510RGBA-SG  [LED-SMD_FM-3510RGBA-SG]  45.58 45.12 90 bottom
LED8  FM-3510RGBA-SG  [LED-SMD_FM-3510RGBA-SG]  45.07 38.01 80 bottom
LED9  FM-3510RGBA-SG  [LED-SMD_FM-3510RGBA-SG]  26.66 83.03 210 bottom
LED10  FM-3510RGBA-SG  [LED-SMD_FM-3510RGBA-SG]  21.83 78.24 230 bottom
LED11  FM-3510RGBA-SG  [LED-SMD_FM-3510RGBA-SG]  17.77 72.53 240 bottom
LED12  FM-3510RGBA-SG  [LED-SMD_FM-3510RGBA-SG]  14.59 66.07 250 bottom
LED13  FM-3510RGBA-SG  [LED-SMD_FM-3510RGBA-SG]  12.43 59.21 260 bottom
LED14  FM-3510RGBA-SG  [LED-SMD_FM-3510RGBA-SG]  11.42 52.23 265 bottom
LED15  FM-3510RGBA-SG  [LED-SMD_FM-3510RGBA-SG]  11.29 45.24 270 bottom
LED16  FM-3510RGBA-SG  [LED-SMD_FM-3510RGBA-SG]  11.8 38.13 280 bottom
LED17  -  [3mm_cycling_led]  33.52 19.47 170 bottom
LED18  -  [3mm_cycling_led]  28.44 19.98 180 bottom
LED19  -  [3mm_cycling_led]  23.36 19.47 190 bottom
R1  10kΩ  [RES-ADJ-SMD_3P-L3.0-W3.8-P1.75-BR]  22.59 31.55 0 bottom
R2  10kΩ  [RES-ADJ-SMD_3P-L3.0-W3.8-P1.75-BR]  17.26 31.54 0 bottom
R3  10kΩ  [RES-ADJ-SMD_3P-L3.0-W3.8-P1.75-BR]  17.26 27.85 0 bottom
R6  100Ω  [RES-ADJ-SMD_TC33X-2-104E]  22.47 27.85 90 bottom
R7  100Ω  [RES-ADJ-SMD_TC33X-2-104E]  33.52 27.85 90 bottom
R8  1M  [R0805]  41.14 31.66 90 bottom
RN1  220Ω  [RES-ARRAY-SMD_0402-8P-L2.0-W1.0-BL]  33.52 72.05 90 bottom
RN2  220Ω  [RES-ARRAY-SMD_0402-8P-L2.0-W1.0-BL]  23.61 72.3 270 bottom
RN3  100Ω  [RES-ARRAY-SMD_0402-8P-L2.0-W1.0-BL]  27.67 31.92 0 bottom
RN4  150Ω  [RES-ARRAY-SMD_0402-8P-L2.0-W1.0-BL]  21.07 53 0 bottom
RN5  150Ω  [RES-ARRAY-SMD_0402-8P-L2.0-W1.0-BL]  22.21 63.92 180 bottom
RN6  100Ω  [RES-ARRAY-SMD_0402-8P-L2.0-W1.0-BL]  38.22 52.87 0 bottom
RN7  100Ω  [RES-ARRAY-SMD_0402-8P-L2.0-W1.0-BL]  34.98 63.86 180 bottom
U1  74HC164D  [SOP-14_L8.6-W3.9-P1.27-LS6.0-BL]  28.56 72.56 270 bottom
U2  TLC555DRG  [SOP-8_L5.0-W3.9-P1.27-LS6.0-BL]  29.96 43.85 180 bottom
U3  74HC164D  [SOP-14_L8.6-W3.9-P1.27-LS6.0-BL]  21.83 58.46 180 bottom
U4  TLC555DRG  [SOP-8_L5.0-W3.9-P1.27-LS6.0-BL]  23.61 43.85 180 bottom
U5  74HC164D  [SOP-14_L8.6-W3.9-P1.27-LS6.0-BL]  35.23 58.52 180 bottom
U6  TLC555DRG  [SOP-8_L5.0-W3.9-P1.27-LS6.0-BL]  17.26 43.85 180 bottom
U7  RS3G14XM  [MSOP-8_L3.0-W3.0-P0.65-LS4.9-BL]  28.69 51.73 90 bottom
U8  LM2675M-3.3(UMW)  [SOIC-8_L4.9-W3.8-P1.27-LS6.0-BL]  40.25 41.44 270 bottom

## Footprints (pads in the part's own frame, mm; a bottom-side part is the same pattern mirrored in y, then rotated)
3mm_cycling_led
  rect 1.524x5 smd: 1(1.27,0) 2(-1.27,0)
C0402
  rect 0.5x0.54 smd: 1(-0.42,0) 2(0.42,0)
C0805
  rect 1.41x1.35 smd: 1(-1,0) 2(1,0)
CAP-SMD_BD8.0-L8.3-W8.3-FD
  rect 4.2x1.4 smd: 1(-3.267,0) 2(3.267,0)
CAP-SMD_L6.0-W3.2-R-RD
  rect 1.9x2.376 smd: 1(2.6,0) 2(-2.6,0)
DC-IN_DC050-T
  rect 2x3 smd: 1(-3.05,-5.5) 1(3.05,-5.5) 2(3.05,5.5) 3(-3.05,5.5)
jumper3_12
  rect 1x1.5 smd: 1(-1.3,0) 2(0,0) 3(1.3,0)
L0805
  rect 1.133x1.377 smd: 1(-0.966,0) 2(0.966,0)
LED-SMD_FM-3510RGBA-SG
  rect 0.6x0.5 smd: 1(-1.46,0.062) 4(1.46,0.062)
  rect 0.44x0.75 smd: 2(-0.39,-0.062) 3(0.51,-0.062)
MSOP-8_L3.0-W3.0-P0.65-LS4.9-BL
  rect 0.406x1.397 smd: 1(-0.975,-2.3) 2(-0.325,-2.3) 3(0.325,-2.3) 4(0.975,-2.3) 5(0.975,2.3) 6(0.325,2.3) 7(-0.325,2.3) 8(-0.975,2.3)
R0805
  rect 1.133x1.377 smd: 1(-1,0) 2(1,0)
RES-ADJ-SMD_3P-L3.0-W3.8-P1.75-BR
  rect 1.2x1.2 smd: 1(1.625,-1) 3(1.625,1)
  rect 1.5x1.6 smd: 2(-1.625,0)
RES-ADJ-SMD_TC33X-2-104E
  rect 1.2x1.2 smd: 1(-0.95,-1.6) 3(0.95,-1.6)
  rect 1.6x1.5 smd: 2(0,1.6)
RES-ARRAY-SMD_0402-8P-L2.0-W1.0-BL
  rect 0.3x0.505 smd: 1(-0.75,0.427) 2(-0.25,0.427) 3(0.25,0.427) 4(0.75,0.427) 5(0.75,-0.427) 6(0.25,-0.427) 7(-0.25,-0.427) 8(-0.75,-0.427)
SOD-123_L2.7-W1.6-LS3.7-RD-1
  rect 1.2x0.95 smd: 1(-1.7,0) 2(1.7,0)
SOIC-8_L4.9-W3.8-P1.27-LS6.0-BL
  oval 0.588x2.045 smd: 1(-1.905,-2.772) 2(-0.635,-2.772) 3(0.635,-2.772) 4(1.905,-2.772) 5(1.905,2.772) 6(0.635,2.772) 7(-0.635,2.772) 8(-1.905,2.772)
SOP-8_L5.0-W3.9-P1.27-LS6.0-BL
  oval 0.6x1.52 smd: 1(-1.905,-2.74) 2(-0.635,-2.74) 3(0.635,-2.74) 4(1.905,-2.74) 5(1.905,2.74) 6(0.635,2.74) 7(-0.635,2.74) 8(-1.905,2.74)
SOP-14_L8.6-W3.9-P1.27-LS6.0-BL
  oval 0.595x1.968 smd: 1(-3.81,-2.734) 2(-2.54,-2.734) 3(-1.27,-2.734) 4(0,-2.734) 5(1.27,-2.734) 6(2.54,-2.734) 7(3.81,-2.734) 8(3.81,2.734) 9(2.54,2.734) 10(1.27,2.734) 11(0,2.734) 12(-1.27,2.734) 13(-2.54,2.734) 14(-3.81,2.734)

## Nets
As in the schematic.

Pads without a net: DC1 3; R1 1; R2 1; R3 1; R6 1; R7 1; RN3 1 8; U2 5; U4 5; U6 5; U8 2 3

## Via types
v1: diameter 0.61, hole 0.305, Top Layer to Bottom Layer, 177 vias

## Routing (per net, layer and track width the routed paths; a pad name or vN(x,y) marks a point on that pad's centre or on a via; arc(x,y) is an arc through that point)
3V3: length 48.9
  Top Layer w0.254: v1(37.2,30.25) 37.2,30.5 v1(39.61,32.92)
  Bottom Layer w0.254: 30.04,29.06 21.12,29.06 R6.3 ; 30.04,29.06 31.66,29.06 31.92,28.8 ; 30.04,29.06 31.23,30.25 v1(37.2,30.25) ; R8.1 39.61,32.19 v1(39.61,32.92) 39.61,35.15 C13.1 38.66,36.49 41.7,39.54 U8.4 43.53,39.54 44.54,40.55 44.54,43.6 40.61,47.54 37.76,47.54 L1.2
3V3S: length 292.2
  Top Layer w0.254: v1(31.2,50.08) 31.2,48.81 v1(30.43,48.05) ; v1(35.75,78.4) 33.97,80.18 v1(33.82,80.18) ; v1(42.12,55.92) 42.12,56.18 41.61,56.69 41.61,59.73 v1(40.85,60.5) ; 16.04,59.97 16.28,60.21 18.58,60.21 v1(18.83,59.95) ; 16.04,59.97 v1(16.04,58.68) ; 16.04,59.97 15.78,60.22 15.78,61.07 16.26,61.55 16.26,68.37 15.27,69.35 v1(15.02,69.35) 15.02,69.61 17.31,71.89 v1(17.31,73.8) 18.07,74.56 v1(18.07,75.45)
  Bottom Layer w0.254: 19.29,60.42 19.8,60.42 21.25,58.97 23.67,58.97 25.64,60.94 U3.14 26.55,61.19 C3.2 26.62,60.87 27.55,59.94 ; 19.29,60.42 v1(18.83,59.95) ; 19.29,60.42 19.29,61.19 ; 25.66,78.47 25.66,77.96 C11.2 25.83,77.23 U1.14 26.08,76.37 27.1,75.35 27.1,71.03 26.08,70.02 25.83,70.02 ; 25.66,78.47 22.16,78.47 LED10.2 22.13,79 21.88,79.26 ; 25.66,78.47 C10.2 27.03,80.4 LED9.2 ; 21.88,79.26 20.86,79.26 18.07,76.46 v1(18.07,75.45) ; 21.88,79.26 21.88,80.78 26.87,85.77 29,85.77 30.52,84.25 30.52,82.98 ; U6.4 15.01,40.77 C9.2 13.94,40.77 ; 11.46,48.52 11.46,48.02 10.59,47.14 10.59,46.4 LED15.2 12.12,45.63 13.39,44.36 13.39,41.32 13.94,40.77 ; 11.46,48.52 12.23,48.52 13.04,47.71 18.07,47.71 19.08,46.69 ; 11.46,48.52 11.46,48.78 13.24,50.56 13.24,54.62 16.09,57.47 16.09,58.63 v1(16.04,58.68) ; 31.96,47.06 31.96,46.69 U2.8 ; 31.96,47.06 31.99,47.03 35.51,47.03 38.31,49.83 40.09,49.83 ; 31.96,47.06 31.69,46.8 30.69,47.8 30.43,47.8 ; 40.09,49.83 40.09,49.33 44.69,44.73 LED7.2 ; 40.09,49.83 40.09,50.59 41.1,51.61 41.1,51.86 43.13,53.89 43.39,53.89 ; 30.43,47.8 28.91,47.8 28.15,48.56 27.64,48.56 26.88,47.8 26.88,46.78 26.02,45.93 ; 30.43,47.8 v1(30.43,48.05) ; v1(35.75,78.4) 35.5,78.15 ; 35.5,78.15 35.75,78.15 39.75,74.15 39.75,72.57 LED3.2 ; 35.5,78.15 35.24,77.9 LED2.2 ; 12.51,59.59 11.8,60.29 11.8,68.29 v1(17.31,73.8) 17.31,73.55 LED11.2 ; 12.51,59.59 LED13.2 ; 12.51,59.59 12.25,59.59 11.52,58.85 11.52,54.78 12.28,54.02 12.28,53.37 LED14.2 ; 45.17,51.72 44.66,52.23 44.66,52.62 43.39,53.89 ; 45.17,51.72 45.43,51.72 ; 45.17,51.72 44.91,51.47 44.91,48.93 46.94,46.9 46.94,39.28 45.31,37.64 LED8.2 ; 26.02,45.93 26.02,43.39 27.55,41.86 27.55,41.35 ; 26.02,45.93 26.02,46.09 U4.8 ; C5.2 20.69,40.77 21.2,41.28 ; 27.55,41.35 26.96,40.77 C1.2 ; 27.55,41.35 27.82,41.35 U2.4 ; 19.08,46.69 20.35,45.42 20.35,42.63 21.2,41.78 21.2,41.28 ; 19.08,46.69 U6.8 ; 30.52,82.98 31.79,82.98 33.82,80.94 v1(33.82,80.18) ; 30.52,82.98 LED1.2 ; 39.83,61 39.8,61 39.55,61.26 U5.14 39.04,61 38.02,59.99 33.71,59.99 32.69,61 U5.9 32.69,61.51 31.67,62.53 30.13,62.53 27.55,59.94 ; 39.83,61 C7.2 ; 39.83,61 39.83,60.5 40.34,59.99 ; 27.55,59.94 C2.2 ; LED12.2 14.26,66.94 14.26,68.59 v1(15.02,69.35) ; v1(31.2,50.08) 31.2,50.55 U7.8 ; 40.34,59.99 40.87,59.46 C6.2 ; 40.34,59.99 v1(40.85,60.5) ; 21.2,41.28 21.55,41.28 U4.4 ; 13.94,40.77 13.94,40.67 LED16.2 11.03,37.76 11.03,36.14 R2.2 ; 43.39,53.89 43.13,54.15 43.13,54.91 v1(42.12,55.92) 44.15,57.96 44.15,58.4 44.45,58.7 43.94,58.7 42.41,60.22 42.41,63.13 43.62,64.35 43.62,64.85 42.91,65.56 LED4.2 ; R2.2 20.96,31.54 R1.2 ; R2.2 R3.2 15.71,27.92 24,27.92 R6.2
3V3T: length 34.5
  Bottom Layer w0.254: 28.44,17.69 28.44,18.71 LED18.1 ; 28.44,17.69 27.42,16.68 24.12,16.68 22.11,18.69 LED19.1 22.11,21.28 26.52,25.69 32.99,25.69 32.99,25.72 R7.2 ; 28.44,17.69 28.44,17.44 28.69,17.19 30.72,17.19 32.25,18.71 32.25,19.67 LED17.1
24V: length 29
  Top Layer w0.254: v1(37.12,37.43) 37.27,37.29 v1(40.29,37.29)
  Bottom Layer w0.254: R8.2 41.64,33.17 D1.1 ; 37.48,39.38 U8.5 ; 37.48,39.38 37.48,38.87 37.12,38.52 v1(37.12,37.43) ; 37.48,39.38 37.73,39.38 39,40.65 39,40.91 37.83,42.08 U8.7 ; v1(40.29,37.29) 41.64,35.93 D1.1 ; D1.1 50.99,25.06 50.99,24.48
GND: length 184.4
  Top Layer w0.254: v1(25.96,64.94) 26.22,65.19 26.22,68.49 28.25,70.52 v1(28.89,70.52) ; v1(26.64,53.21) v1(26.64,48.64) ; 20.55,41.57 19.83,42.29 v1(19.74,42.29) ; 20.55,41.57 20.8,41.57 22.2,40.17 v1(24.99,40.17) 26.26,38.9 28.24,38.9 29.18,39.85 29.18,40.3 29.69,40.81 30.45,40.81 v1(31.21,40.04) 33.25,38.01 v1(33.25,37.76) ; 20.55,41.57 20.55,40.04 20.04,39.54 17.24,39.54 v1(14.7,42.08) ; v1(39.8,62.14) 39.8,60.12 40.06,59.85 40.06,58.58 v1(39.8,58.33) ; v1(28.06,61.32) 28.06,58.78 v1(28.56,58.27)
  Bottom Layer w0.254: 28.82,55.99 28.82,55.54 29.33,55.03 30.66,55.03 U5.7 31.42,56.04 33.6,58.22 ; 28.82,55.99 28.82,56.24 27.8,57.26 27.8,57.51 ; 28.82,55.99 27.8,54.97 27.8,53.95 26.55,52.7 26.39,52.7 26.39,52.96 v1(26.64,53.21) ; C10.1 26.95,78.33 C11.1 27.74,76.72 27.74,71.67 v1(28.89,70.52) 30.66,68.75 U1.7 ; U3.7 18.02,56.19 18.91,57.08 27.29,57.08 C2.1 27.8,57.51 ; 26.64,41.78 26.64,42.04 24.87,43.81 24.87,47.37 25.37,47.88 25.88,47.88 v1(26.64,48.64) ; 26.64,41.78 26.64,41.75 C1.1 ; 26.64,41.78 26.18,41.78 U4.1 25.52,39.43 C8.2 24.99,39.16 v1(24.99,40.17) ; v1(39.8,62.14) 40.31,62.14 40.82,61.63 40.82,61.36 C7.1 ; LED19.2 24.61,21.23 26.28,22.9 28.06,22.9 30.09,20.87 ; 27.49,61.38 27.49,62.65 25.96,64.17 v1(25.96,64.94) ; 27.49,61.38 28,61.38 v1(28.06,61.32) ; 27.49,61.38 C3.1 ; 30.09,20.87 31.87,22.65 33.33,22.65 35.87,20.11 ; 30.09,20.87 29.71,20.49 LED18.2 ; DC1.2 35.01,16.48 35.01,19.25 ; 35.87,20.11 35.01,19.25 ; 35.87,20.11 42.73,26.96 ; v1(39.8,58.33) 33.71,58.33 33.6,58.22 ; 33.6,58.22 40.12,58.22 C6.1 ; 35.01,19.25 LED17.2 ; 42.73,26.96 33.58,36.11 C13.2 33.25,36.32 v1(33.25,37.76) 33.25,37.95 D2.2 36.11,40.81 U8.6 ; 42.73,26.96 43.3,26.39 44.74,26.39 ; C4.2 31.21,39.54 v1(31.21,40.04) 31.21,40.46 U2.1 ; 27.8,57.51 v1(28.56,58.27) ; 19.28,41.06 18.77,40.55 C12.2 ; 19.28,41.06 19.28,41.82 v1(19.74,42.29) 19.75,42.29 C5.1 ; 19.28,41.06 U6.1 ; v1(14.7,42.08) 14.55,42.08 C9.1
B0: length 46.4
  Top Layer w0.254: v1(28.73,84.52) 30.51,84.52 v1(36.6,78.42) ; v1(41.03,64.36) 41.03,65.36 39.4,66.99 v1(39.4,68.77)
  Bottom Layer w0.254: RN6.4 40.41,53.89 40.41,55.05 41.94,56.58 41.94,63.45 v1(41.03,64.36) ; 25.36,82.35 25.36,82.86 27.02,84.52 28.22,84.52 28.47,84.26 ; 28.47,84.26 v1(28.73,84.52) ; 28.47,84.26 28.98,83.75 ; v1(36.6,78.42) 40.67,74.36 40.67,71.05 39.4,69.78 v1(39.4,68.77)
B1: length 54.6
  Top Layer w0.254: v1(41.05,52.64) 40.31,52.64 v1(39.29,51.62) ; v1(20.85,78.29) 23.39,80.83 31.36,80.83 v1(32.88,79.3) ; v1(42.43,54.01) 42.14,54.31 42.08,54.31 41.74,54.65 41.74,54.7 40.94,55.5 40.94,59.56 40.25,60.25 40.25,61.77 40.38,61.9 40.38,63.29 40.86,63.77 41.27,63.77 41.9,64.4 41.9,65.2 40.25,66.86 v1(40.25,69.65)
  Bottom Layer w0.254: RN6.3 38.53,52.38 38.53,51.87 38.79,51.62 v1(39.29,51.62) ; LED10.4 20.59,77.41 20.59,78.03 v1(20.85,78.29) ; v1(42.43,54.01) v1(41.05,52.64) ; v1(40.25,69.65) 41.26,70.67 41.26,74.73 36.69,79.3 LED2.4 v1(32.88,79.3)
B2: length 48.9
  Top Layer w0.254: 37.97,71.23 37.97,67.03 39.52,65.48 39.52,64.9 v1(39.77,64.65) ; 37.97,71.23 v1(37.97,72.5) ; 37.97,71.23 23.74,71.23 22.98,70.47 21.33,70.47 v1(21.2,70.6) ; v1(39,63.72) 38.1,62.82 38.1,51.81 v1(37.97,51.67) ; v1(18.66,70.47) 16.76,70.47 v1(16.12,69.83)
  Bottom Layer w0.254: LED11.4 16.12,70.44 v1(16.12,69.83) ; v1(21.2,70.6) 18.79,70.6 v1(18.66,70.47) ; v1(39,63.72) 39.77,64.49 v1(39.77,64.65) ; v1(37.97,51.67) RN6.2 ; 38.43,73.73 37.97,73.26 v1(37.97,72.5)
B3: length 54.7
  Top Layer w0.254: v1(42.86,66.84) 42.86,57.07 43.65,56.28 43.65,55.58 42.96,54.89 v1(42.33,54.89) ; v1(37.52,66.08) 34.98,68.62 v1(33.46,68.62)
  Bottom Layer w0.254: v1(42.86,66.84) 42.35,67.35 LED4.4 41.08,66.58 38.03,66.58 v1(37.52,66.08) ; LED12.4 14.71,64.04 15.42,64.04 17.38,66 30.84,66 v1(33.46,68.62) ; v1(42.33,54.89) 42.2,54.89 40.06,52.75 40.06,51.48 39.55,50.98 37.78,50.98 37.27,51.48 37.27,52.25 RN6.1
B4: length 49.7
  Top Layer w0.254: v1(29.52,66.64) 29.77,66.39 v1(34.34,66.39) v1(36.37,66.39) ; v1(15.64,65.37) 14.62,65.37 12.85,63.59 v1(12.85,57.79)
  Bottom Layer w0.254: v1(34.34,66.39) 33.33,65.37 33.33,64.86 33.9,64.29 RN7.4 ; v1(29.52,66.64) 16.91,66.64 v1(15.64,65.37) ; v1(36.37,66.39) 37.14,67.15 40.69,67.15 41.71,68.16 42.47,68.16 44.25,66.39 LED5.4 ; v1(12.85,57.79) LED13.4
B5: length 65.1
  Top Layer w0.254: v1(12.17,55.02) 12.17,52.74 v1(10.64,51.21) ; v1(26.39,60.22) 25.63,60.99 25.63,63.14 26.25,63.76 27.42,63.76 v1(27.66,63.52) ; v1(19.53,59.59) 19.53,60.1 18.79,60.84 v1(16.38,60.84) ; v1(31.73,64.29) 32.49,65.05 v1(34.01,65.05)
  Bottom Layer w0.254: 34.77,65.05 v1(34.01,65.05) ; 34.77,65.05 34.77,65.81 36.55,67.59 40.36,67.59 41.38,68.6 42.65,68.6 45.39,65.86 LED6.4 ; 34.77,65.05 34.77,64.33 34.73,64.29 ; v1(26.39,60.22) 24.63,58.46 20.67,58.46 v1(19.53,59.59) ; LED14.4 10.8,51.21 v1(10.64,51.21) ; v1(16.38,60.84) 13.43,57.89 13.43,57.54 13.09,57.2 12.74,57.2 12.17,56.63 v1(12.17,55.02) ; v1(31.73,64.29) 30.96,63.52 v1(27.66,63.52)
B6: length 61.6
  Top Layer w0.254: 42.03,52.49 41.77,52.24 41.77,50.43 34.83,43.49 12.93,43.49 v1(12.63,43.78) ; 42.03,52.49 38.45,56.06 38.45,61.85 39.51,62.9 v1(39.51,63.15) ; 42.03,52.49 42.09,52.55 42.72,51.92 v1(42.72,51.54)
  Bottom Layer w0.254: RN7.2 35.23,64.71 35.56,65.05 36.85,65.05 38.94,62.95 39.3,62.95 v1(39.51,63.15) ; v1(42.72,51.54) 42.72,49.51 45.64,46.58 ; v1(12.63,43.78) LED15.4
B7: length 83.9
  Top Layer w0.254: v1(12.5,37.02) 11.1,38.42 11.1,45.28 v1(14.15,48.33) ; v1(37.26,59.25) 37.74,59.73 v1(37.74,63.32) ; v1(37.47,44.28) 43.61,50.42 v1(43.61,52.27) 43.25,52.27 39.04,56.48 39.04,59.51 v1(39.29,59.76) ; v1(20.94,44.07) 21.13,44.27 31.67,44.27 v1(31.93,44.52)
  Bottom Layer w0.254: v1(39.29,59.76) 38.79,59.25 v1(37.26,59.25) ; 45.39,39.44 46.4,40.46 46.4,46.81 43.61,49.6 v1(43.61,52.27) ; v1(12.5,37.02) 12.33,37.02 LED16.4 ; v1(20.94,44.07) 20.94,46.11 18.72,48.33 v1(14.15,48.33) ; v1(37.47,44.28) 37.29,44.46 36.65,44.46 36.59,44.52 v1(31.93,44.52) ; v1(37.74,63.32) 36.78,64.29 35.73,64.29
B_CLOCK: length 30.8
  Top Layer w0.254: v1(26.69,45.51) 29.23,48.05 29.23,49.07 29.53,49.37 29.53,53.72 29.52,53.72 29.52,54.21 29.53,54.21 v1(29.53,55.72)
  Bottom Layer w0.254: U5.8 29.53,59.37 v1(29.53,55.72) ; 29.83,35.48 J2.2 ; 29.89,35.54 30.26,35.54 30.72,36 30.72,37.18 29.86,38.04 28.94,38.04 28.72,38.26 28.72,43.48 v1(26.69,45.51)
B_OSC: length 16.6
  Top Layer w0.254: v1(15.61,39.84) 16.63,38.83 23.23,38.83 24.5,37.56 28.09,37.56 v1(28.26,37.73)
  Bottom Layer w0.254: v1(15.61,39.84) 16.63,40.86 U6.3 ; v1(28.26,37.73) 28.53,37.73 29.19,37.06
BDIS: length 37.3
  Top Layer w0.254: v1(18.7,42.51) 18.7,41.13 v1(19.7,40.12) ; v1(22.57,24.55) 22.57,29.01 25.3,31.74 26.06,31.74 v1(26.32,32)
  Bottom Layer w0.254: v1(18.7,42.51) 18.7,45.79 18.59,45.89 18.59,45.9 U6.7 ; R3.3 21.32,24.42 22.45,24.42 v1(22.57,24.55) ; v1(19.7,40.12) 19.7,39.87 19.75,39.82 19.75,38.57 23.56,34.76 23.56,33.48 23.3,33.23 23.3,31.72 23.35,31.67 25.99,31.67 v1(26.32,32) 26.32,31.24 26.82,30.73 27.08,30.73 27.42,31.07 RN3.2
BIN: length 12.5
  Top Layer w0.254: v1(36.93,50.44) 34.79,48.3 v1(33.26,48.3)
  Bottom Layer w0.254: v1(33.26,48.3) 31.95,48.3 29.98,50.28 29.98,51.8 30.23,52.05 U7.6 ; J5.2 36.07,50.44 v1(36.93,50.44)
BQ: length 15.2
  Top Layer w0.254: v1(34.79,52.69) 34.79,60.16 v1(37.07,62.44)
  Bottom Layer w0.254: 35.73,63.43 36.08,63.43 v1(37.07,62.44) 37.77,61.74 U5.13 ; v1(34.79,52.69) 35.13,52.69 J5.1
BTT: length 22.6
  Top Layer w0.254: v1(25.91,33.82) 25.71,34.03 v1(22.8,34.03)
  Bottom Layer w0.254: 17.02,39.28 17.53,39.79 17.53,40.55 17.79,40.81 ; 17.02,39.28 C12.1 ; 17.02,39.28 17.02,38.77 21.77,34.03 v1(22.8,34.03) ; 17.79,40.81 17.28,41.31 17.28,45.94 U6.6 ; 17.79,40.81 17.9,40.92 U6.2 ; RN3.7 27.42,32.69 27.18,32.93 26.8,32.93 26.34,33.39 26.3,33.39 26.14,33.56 26.14,33.6 v1(25.91,33.82)
G0: length 44.7
  Top Layer w0.254: v1(23.65,80.12) 18.57,75.04 18.57,73.52 19.33,72.76 19.33,63.36 20.85,61.84 20.85,55.23 v1(22.63,53.45)
  Bottom Layer w0.254: LED9.3 26.19,82.66 26.19,82.16 25.68,81.65 25.17,81.65 ; 25.17,81.65 24.66,82.16 24.66,82.92 26.95,85.2 28.98,85.2 29.74,84.44 LED1.3 ; 25.17,81.65 v1(23.65,80.12) ; RN4.4 22.63,53.38 v1(22.63,53.45)
G1: length 45.6
  Top Layer w0.254: v1(21.82,74.79) 19.8,72.76 19.8,63.63 21.32,62.1 21.32,55.62 23.35,53.59 23.35,52.32 v1(21.7,50.67) ; v1(33.65,77.99) 22.98,77.99 v1(22.73,77.73)
  Bottom Layer w0.254: v1(22.73,77.73) 21.71,77.73 ; 21.71,77.73 21.55,77.81 ; 21.71,77.73 21.82,77.62 v1(21.82,74.79) ; v1(21.7,50.67) 21.7,51.68 21.32,52.06 RN4.3 ; v1(33.65,77.99) 34.16,78.5 LED2.3
G2: length 56
  Top Layer w0.254: v1(36,73.09) 35.75,72.84 26.35,72.84 23.82,75.37 21.5,75.37 v1(20.41,74.28) ; v1(15.03,61.65) 14.72,61.34 14.72,57.82 18.01,54.54 v1(18.68,54.54)
  Bottom Layer w0.254: RN4.2 20.82,52.2 20.62,51.99 18.52,51.99 17.26,53.25 17.26,54.01 17.71,54.46 18.26,54.46 18.34,54.54 v1(18.68,54.54) ; v1(36,73.09) 37.53,74.62 38.54,74.62 39.3,73.86 39.3,73.35 LED3.3 ; v1(20.41,74.28) 18.73,72.6 18.73,72.57 18.35,72.18 18.03,72.18 17.91,72.06 LED11.3 16.81,72.06 13.25,68.5 13.25,63.42 v1(15.03,61.65)
G3: length 55.2
  Top Layer w0.254: v1(30.36,55.62) 30.36,54.22 v1(30.11,53.96) ; v1(20.71,50.66) 20.71,50.97 v1(18.05,53.63) 18.09,53.67 18.09,53.7 14.36,57.42 14.36,64.12 v1(14.99,64.75) ; v1(32.65,59.81) 37.51,64.67 v1(38.18,64.67) ; v1(27.82,52.69) 27.82,48.88 26.81,47.87 26.55,47.87 v1(25.79,48.63)
  Bottom Layer w0.254: v1(18.05,53.63) 18.62,53.06 19.89,53.06 20.32,52.63 RN4.1 ; v1(32.65,59.81) 30.36,57.52 v1(30.36,55.62) ; v1(30.11,53.96) 29.09,53.96 v1(27.82,52.69) ; v1(20.71,50.66) 20.71,50.54 22.62,48.63 22.74,48.63 22.74,48.63 v1(25.79,48.63) ; v1(14.99,64.75) 14.99,65.06 14.48,65.56 ; v1(38.18,64.67) 39.67,66.16 41.79,66.16 42.05,66.41
G4: length 45
  Top Layer w0.254: v1(20.86,64.19) 21.11,64.45 21.52,64.45 21.62,64.35 v1(26.7,64.35) ; v1(43.53,63.14) 43.53,67.08 42.95,67.65 42.45,67.65 v1(40.92,69.17)
  Bottom Layer w0.254: RN5.4 21.31,64.19 v1(20.86,64.19) 19.33,62.67 17.38,62.67 13.41,58.7 LED13.3 ; v1(40.92,69.17) 39.91,68.16 34.07,68.16 30.26,64.35 v1(26.7,64.35) ; LED5.3 44.04,59.59 43.53,60.09 v1(43.53,63.14)
G5: length 57.3
  Top Layer w0.254: v1(40.27,64.04) 39.5,64.04 39.16,64.38 39.16,64.75 38.42,65.49 34.5,65.49 34.17,65.82 30.62,65.82 v1(29.85,65.06) ; v1(43.06,55.91) 42.05,56.93 42.05,62.5 v1(41.35,63.19) ; v1(15.51,58.07) 18.99,58.07 20.13,59.22 20.13,61.76 v1(18.23,63.66)
  Bottom Layer w0.254: v1(41.35,63.19) 41.12,63.19 v1(40.27,64.04) ; RN5.3 21.96,64.75 21.66,65.06 ; 21.66,65.06 22.17,65.57 29.35,65.57 v1(29.85,65.06) ; 21.66,65.06 19.63,65.06 v1(18.23,63.66) ; LED14.3 11.69,51.72 12.71,52.73 12.71,54.76 ; 12.75,54.81 15.51,57.57 v1(15.51,58.07) ; LED6.3 43.57,54.39 43.57,55.41 v1(43.06,55.91)
G6: length 66.4
  Top Layer w0.254: 34.09,51.18 34.09,51.73 33.07,52.75 33.07,55.03 32.06,56.05 32.06,61.64 33.07,62.65 33.07,63.16 32.57,63.67 29.52,63.67 28.17,62.32 v1(26.57,62.32) ; 34.09,51.18 34.13,51.22 36.98,51.22 37.67,50.53 37.78,50.53 37.81,50.5 v1(40.82,50.5) ; 34.09,51.18 34.09,50.71 28.11,44.73 21.64,44.73 21.14,45.24 12.88,45.24 v1(12.25,44.61)
  Bottom Layer w0.254: LED7.3 40.82,50.33 v1(40.82,50.5) ; RN5.2 22.46,64.83 22.74,65.11 23.78,65.11 v1(26.57,62.32) ; v1(12.25,44.61) 11.48,44.61 LED15.3
G7: length 77.2
  Top Layer w0.254: v1(12.84,38.02) 11.57,39.29 11.57,44.88 16.52,49.82 21.71,49.82 24.27,52.39 24.27,55.04 23,56.31 23,60.96 23.28,61.24 23.28,62.45 23.62,62.79 24.84,62.79 v1(25.04,63) ; v1(42.82,37.76) 42.56,38.02 34.43,38.02 31.13,34.71 30.47,34.71 28.69,36.49 23.25,36.49 v1(20.78,34.02)
  Bottom Layer w0.254: v1(25.04,63) 24.31,63 RN5.1 ; 45.1,38.53 43.58,38.53 v1(42.82,37.76) ; 12.84,37.51 12.71,37.64 LED16.3 ; 12.84,37.51 v1(12.84,38.02) ; 12.84,37.51 13.86,37.51 17.34,34.02 v1(20.78,34.02)
G_CLOCK: length 33.8
  Bottom Layer w0.254: J1.2 26.91,35.22 23.74,35.22 21.2,37.76 21.2,38.97 22.34,40.11 22.34,47.48 16.88,52.94 16.88,56.75 18.02,57.89 U3.8
G_OSC: length 11
  Top Layer w0.254: v1(24.12,42.51) 24.12,41.96 26.73,39.35 27.78,39.35 v1(28.14,39.71)
  Bottom Layer w0.254: U4.3 22.98,41.37 v1(24.12,42.51) ; v1(28.14,39.71) 27.42,38.99 27.42,37.18 27.17,36.92 27.17,36.77
GDIS: length 33.8
  Top Layer w0.254: v1(25.32,42.35) 25.32,42.32 v1(27.5,40.14) ; v1(25.83,35.8) 27.67,35.8 v1(31.04,32.44)
  Bottom Layer w0.254: v1(25.32,42.35) 25.32,42.86 24.25,43.93 U4.7 ; 27.99,31.04 27.99,31.43 RN3.3 ; 27.99,31.04 26.61,29.67 23.5,29.67 22.89,30.28 19.14,30.28 R2.3 ; 27.99,31.04 28.24,30.79 29.38,30.79 v1(31.04,32.44) ; v1(25.83,35.8) 25.83,37.69 26.21,38.07 26.21,38.86 v1(27.5,40.14)
GIN: length 9.5
  Bottom Layer w0.254: J4.2 33.01,50.71 31.99,51.73 31.99,53 31.67,53.32 29.95,53.32 28.68,52.05 26.39,52.05
GQ: length 19
  Top Layer w0.254: v1(23.73,59.87) 24.42,59.87 28.69,55.61 v1(28.69,54.84)
  Bottom Layer w0.254: J4.1 33.01,52.52 33.01,52.56 30.98,54.59 28.95,54.59 v1(28.69,54.84) ; U3.13 23.73,60.55 v1(23.73,59.87) 23.68,59.92 23.68,62.12 22.96,62.83 RN5.8
GTT: length 24.6
  Top Layer w0.254: v1(21.84,38.12) 19.99,36.27 19.99,33.99 20.79,33.19 v1(27.84,33.19)
  Bottom Layer w0.254: U4.6 22.98,44.49 24.74,42.73 24.74,41.61 U4.2 24.25,40.16 C8.1 22.21,38.12 v1(21.84,38.12) ; v1(27.84,33.19) 27.92,33.11 RN3.6
R0: length 15.1
  Bottom Layer w0.254: 27.89,83.81 29.92,81.79 30.49,81.79 ; 30.49,81.79 31,82.29 31.51,82.29 ; 30.49,81.79 30.49,78.99 33.94,75.54 RN1.4
R1: length 20.1
  Top Layer w0.254: v1(24.34,79.35) 25.11,78.59 34,78.59 35.27,77.32 v1(35.27,76.81)
  Bottom Layer w0.254: 35.52,76.56 34.5,75.54 34.5,72.49 34.31,72.3 RN1.3 ; 35.52,76.56 v1(35.27,76.81) ; 35.52,76.56 LED2.1 ; LED10.1 22.77,79.35 v1(24.34,79.35)
R2: length 26.6
  Top Layer w0.254: v1(35.32,73.48) 33.07,75.73 20.67,75.73 v1(19.22,74.28)
  Bottom Layer w0.254: 39.89,71.2 36.33,71.2 35.83,71.7 35.32,71.7 ; 35.32,71.7 v1(35.32,73.48) ; 35.32,71.7 34.55,71.7 34.46,71.8 RN1.2 ; v1(19.22,74.28) 18.89,74.28 LED11.1
R3: length 34.2
  Top Layer w0.254: v1(40.13,65.36) 38.61,66.89 v1(38.61,68.92)
  Bottom Layer w0.254: 34.04,71.21 RN1.1 ; 34.04,71.21 32.77,69.94 32.77,68.67 31.56,67.46 LED12.1 ; 34.04,71.21 35.05,71.21 37.34,68.92 v1(38.61,68.92) ; LED4.1 42.49,64.95 40.55,64.95 v1(40.13,65.36)
R4: length 53.4
  Top Layer w0.254: v1(44.25,57.16) 44.25,67.07 38.15,73.16 37.64,73.16 36.12,71.64 22.84,71.64 v1(22.25,71.05) ; v1(18.74,68.21) 18.74,66.35 v1(17.17,64.78)
  Bottom Layer w0.254: LED5.1 v1(44.25,57.16) ; v1(18.74,68.21) 19.64,68.21 22.25,70.82 v1(22.25,71.05) 22.75,71.55 RN2.4 ; v1(17.17,64.78) 17.17,62.97 14.92,60.72 12.68,60.72 12.63,60.66
R5: length 97
  Top Layer w0.254: 36.75,73.01 36.75,73.27 33.71,76.31 v1(21.01,76.31) ; 36.75,73.01 37.52,73.77 38.53,73.77 v1(41.83,70.47) ; 36.75,73.01 35.99,72.25 26.34,72.25 23.58,75.01 22.87,75.01 20.5,72.64 v1(20.5,71.82) ; v1(18.72,76.06) 17.7,76.06 11.61,69.96 11.61,55.49 v1(10.85,54.72)
  Bottom Layer w0.254: v1(20.5,71.82) 20.73,72.05 RN2.3 ; v1(21.01,76.31) 18.97,76.31 v1(18.72,76.06) ; v1(41.83,70.47) 46.15,66.15 46.15,51.17 LED6.1 ; v1(10.85,54.72) 10.85,54.33 LED14.1
R6: length 69.5
  Top Layer w0.254: v1(16.43,42.9) 16.63,43.1 45.08,43.1 v1(45.14,43.16) ; v1(12.12,47.73) 12.88,48.49 12.88,56.87 12.12,57.63 12.12,64.53 v1(15.67,68.09)
  Bottom Layer w0.254: v1(12.12,47.73) 11.61,47.22 11.61,46.97 ; 11.61,46.97 15.67,42.9 v1(16.43,42.9) ; 11.61,46.97 11.49,46.97 LED15.1 ; v1(15.67,68.09) 15.67,68.34 19.88,72.55 RN2.2 ; LED7.1 v1(45.14,43.16)
R7: length 84.4
  Top Layer w0.254: v1(43.36,36.56) 41.58,36.56 36.75,31.74 29.64,31.74 28.78,32.6 19.63,32.6 v1(12.17,40.07)
  Bottom Layer w0.254: RN2.1 22.48,73.05 20.67,74.86 17.41,74.86 11.04,68.49 11.04,56.04 9.88,54.88 9.88,42.35 v1(12.17,40.07) 11.99,40.07 LED16.1 ; LED8.1 v1(43.36,36.56)
R_CLOCK: length 49.6
  Top Layer w0.254: v1(27.86,47.92) 27.35,47.41 25.83,47.41 25.07,48.17 25.07,57.32 v1(25.58,57.82) ; v1(26.34,58.84) 27.1,59.6 27.1,60.87 25.98,61.99 25.98,62.94 28.15,62.94 28.88,63.67 28.88,68.37 v1(28.37,68.87) ; v1(30.92,35.37) 29.99,36.3 v1(29.99,40.2)
  Bottom Layer w0.254: v1(26.34,58.84) 26.34,58.59 v1(25.58,57.82) ; v1(28.37,68.87) 28.24,68.75 U1.8 ; v1(29.99,40.2) 29.33,40.86 U2.3 29.33,43.51 27.35,45.49 27.35,47.41 v1(27.86,47.92) ; v1(30.92,35.37) 30.92,34.52 30.57,34.18 J2.3 27.17,34.18
RDIS: length 23.4
  Top Layer w0.254: v1(26.29,30.44) 27.81,30.44 v1(28.93,31.57)
  Bottom Layer w0.254: U2.7 30.6,43.87 32.74,41.73 32.74,38.17 31.98,37.41 31.98,34.36 29.19,31.57 v1(28.93,31.57) 28.5,31.57 RN3.4 ; v1(26.29,30.44) 24.33,30.44 R1.3
RIN: length 3.1
  Bottom Layer w0.254: J3.2 23.81,50.46 24.11,50.75 26.39,50.75
RQ: length 30.1
  Top Layer w0.254: v1(23.14,74.43) 23.14,73.43 20.24,70.52 20.24,63.92 22.53,61.63 22.53,55.41 v1(23.54,54.4)
  Bottom Layer w0.254: RN2.8 23.14,73.95 v1(23.14,74.43) 23.81,75.1 U1.13 ; J3.1 22.98,52.52 22.98,52.55 23.54,53.11 v1(23.54,54.4)
RTT: length 17.8
  Bottom Layer w0.254: U2.6 29.33,44.16 30.6,42.89 U2.2 30.6,39.9 C4.1 29.95,39.03 31.5,37.48 31.5,34.46 29.39,32.34 RN3.5
~BQ: length 28.8
  Top Layer w0.254: v1(37.26,56.81) 36.25,55.79 36.25,53.25 34.98,51.98 34.47,51.98 33.74,52.71 v1(33.74,52.97) ; v1(31.93,54.52) 29.9,52.49 v1(29.9,48.68)
  Bottom Layer w0.254: 26.39,51.4 27.17,51.4 27.86,50.71 ; 27.86,50.71 26.57,49.41 J3.3 ; 27.86,50.71 v1(29.9,48.68) ; v1(33.74,52.97) 33.48,52.97 v1(31.93,54.52) ; v1(37.26,56.81) 37.77,56.3 U5.2 U5.1
~GQ: length 19.6
  Top Layer w0.254: v1(28.69,51.41) 28.69,52.68 v1(27.17,54.2)
  Bottom Layer w0.254: v1(28.69,51.41) 28.95,51.41 ; 28.95,51.41 28.95,50.65 31.96,47.63 34.63,47.63 35.8,48.81 J5.3 ; 28.95,51.41 30.24,52.7 U7.5 ; U3.2 U3.1 v1(27.17,54.2)
~RQ: length 35
  Top Layer w0.254: v1(32.24,50.39) 32.24,51.15 32.57,51.47 32.57,54.78 30.79,56.55 30.79,61.38 v1(32.31,62.9) ; v1(30.03,70.52) 33.33,67.22 v1(34.09,67.22)
  Bottom Layer w0.254: U7.7 31.75,51.4 31.99,51.17 31.99,50.64 v1(32.24,50.39) 32.24,50.13 32.96,49.41 J4.3 ; U1.1 U1.2 30.79,75.1 30.03,74.33 v1(30.03,70.52) ; v1(32.31,62.9) 32.31,65.44 v1(34.09,67.22)
$1N6423: length 1.9
  Bottom Layer w0.254: U1.10 24.3,71.29 RN2.5
$1N6425: length 2
  Bottom Layer w0.254: U1.11 25.33,72.05 RN2.6
$1N6427: length 2.4
  Bottom Layer w0.254: 24.04,72.56 24.43,72.56 24.56,72.68 24.56,72.81 25.58,73.83 U1.12
$1N6920: length 34.8
  Bottom Layer w0.254: D1.2 41.64,36.71 53.51,24.84 53.51,23.32 50.72,20.53 DC1.1 48.93,13.92 DC1.1
$1N7048: length 2.7
  Bottom Layer w0.254: U3.10 20.56,62.59 RN5.5
$1N7050: length 2.4
  Bottom Layer w0.254: RN5.6 21.96,61.32 U3.11
$1N7052: length 2.6
  Bottom Layer w0.254: RN5.7 22.46,61.83 U3.12
$1N7110: length 2.8
  Bottom Layer w0.254: RN4.5 21.83,53.44 21.83,54.2 23.1,55.47 U3.3
$1N7112: length 2.5
  Bottom Layer w0.254: U3.4 21.32,55.21 RN4.6
$1N7114: length 2.4
  Bottom Layer w0.254: U3.5 20.82,55.47 RN4.7
$1N7116: length 2.7
  Bottom Layer w0.254: 19.29,55.73 19.29,55.47 20.31,54.46 20.31,53.44 RN4.8
$1N7226: length 2.3
  Bottom Layer w0.254: U5.10 33.96,63.16 RN7.5
$1N7228: length 2.4
  Bottom Layer w0.254: U5.11 34.73,61.76 34.73,63.43
$1N7230: length 2.7
  Bottom Layer w0.254: U5.12 36.5,61.51 35.23,62.78 RN7.7
$1N8445: length 2.9
  Bottom Layer w0.254: C14.2 41.62,44.74 U8.1
$1N8452: length 7.4
  Bottom Layer w0.254: 37.54,45.25 L1.1 ; 37.54,45.25 38.05,45.25 38.56,44.74 C14.1 ; 37.54,45.25 38.22,44.58 38.22,44.09 U8.8 35.25,43.35 D2.1
$1N14384: length 10
  Top Layer w0.254: v1(39.22,53.93) 38.58,53.3 38.58,51.39 38.07,50.88 37.82,50.88 37.01,51.69 v1(37.01,54.77)
  Bottom Layer w0.254: U5.3 36.5,55.28 v1(37.01,54.77) ; RN6.5 39.22,53.55 v1(39.22,53.93)
$1N14386: length 10.2
  Bottom Layer w0.254: U5.4 35.23,56.04 36.75,57.57 38.79,57.57 39.8,56.55 39.8,54.77 39.55,54.52 38.72,54.52 38.47,54.26 RN6.6
$1N14388: length 5.5
  Bottom Layer w0.254: RN6.7 37.97,53.82 37.77,54.01 35.48,54.01 33.96,55.54 U5.5
$1N14390: length 6
  Bottom Layer w0.254: U5.6 32.69,55.54 34.72,53.5 37.26,53.5 RN6.8
$1N14524: length 2.2
  Bottom Layer w0.254: U1.3 32.06,73.83 RN1.5
$1N14526: length 1.9
  Bottom Layer w0.254: RN1.6 31.56,72.3 U1.4
$1N14528: length 2
  Bottom Layer w0.254: RN1.7 31.81,71.8 U1.5
$1N14530: length 2.3
  Bottom Layer w0.254: 31.3,70.02 31.81,70.02 RN1.8

## Text on the board
Bottom Silkscreen Layer: Pattern x3* | Random x3 | Green | Blue | Sync | x2 | Red | All | Async | x2* | JLCJLCJLCJLC | v1r1 | 5-9V / >0.1A | Speed | Thrust
Document Layer: Unsung / Hero
Top Silkscreen Layer: Unsung / Hero
